# EAGLE design camera (EAGLE 9.6.2)
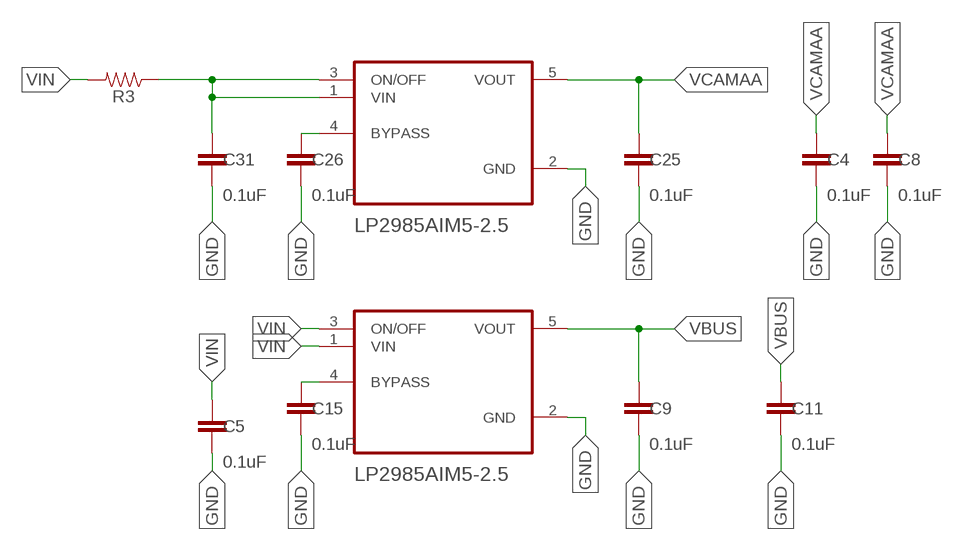
[diagram p0: schematic, sheet 1, part 1 of 3]
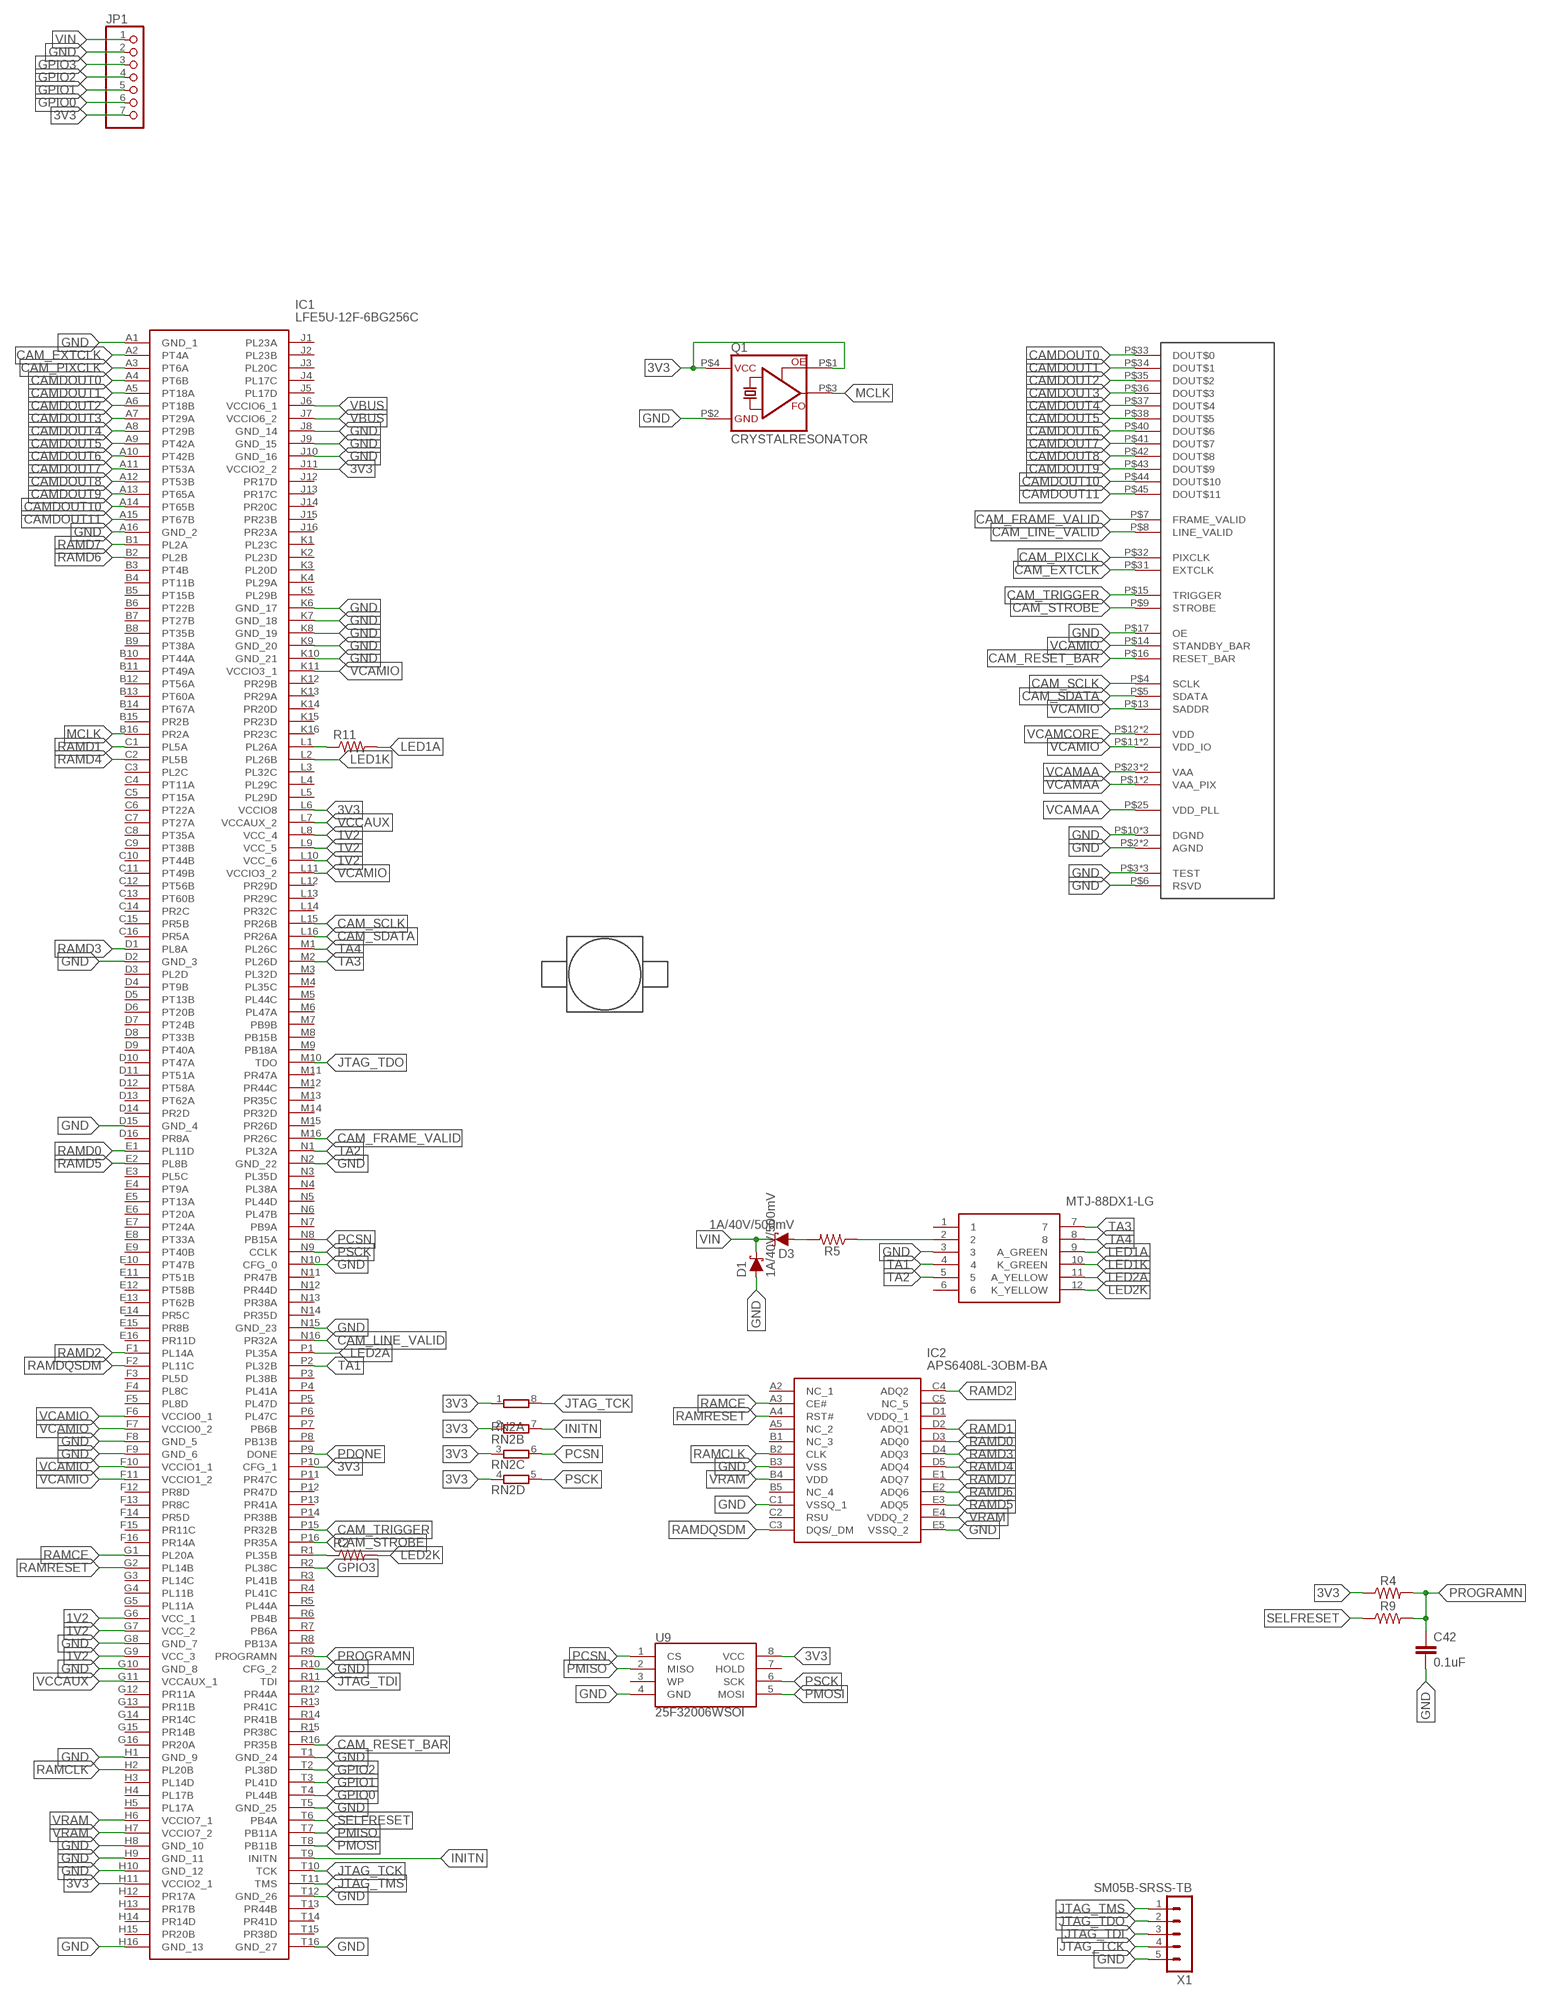
[diagram p1: schematic, sheet 1, part 2 of 3]
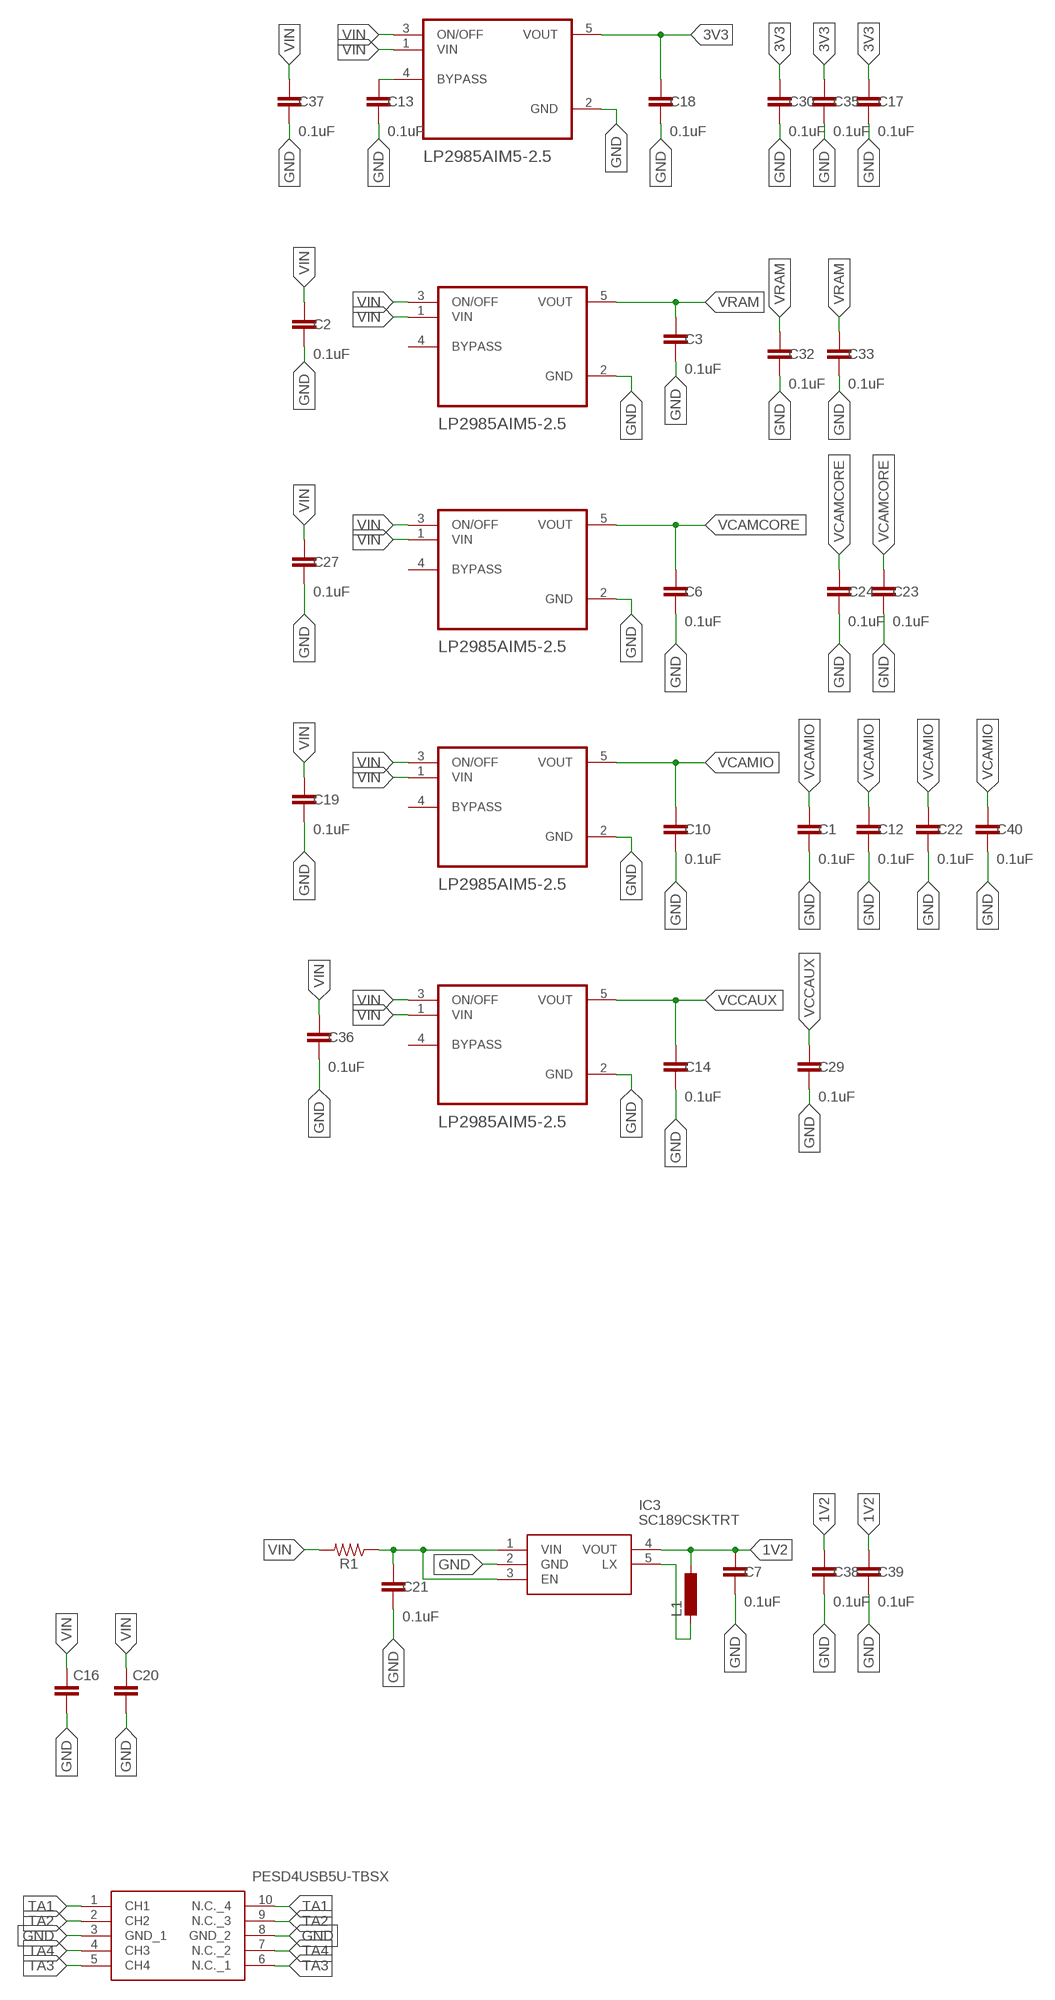
[diagram p2: schematic, sheet 1, part 3 of 3]

## Parts
C1  0.1uF  0.1UF-0603-25V-5%  [0603]
C2  0.1uF  0.1UF-0603-25V-5%  [0603]
C3  0.1uF  0.1UF-0603-25V-5%  [0603]
C4  0.1uF  0.1UF-0603-25V-5%  [0603]
C5  0.1uF  0.1UF-0603-25V-5%  [0603]
C6  0.1uF  0.1UF-0603-25V-5%  [0603]
C7  0.1uF  0.1UF-0603-25V-5%  [0603]
C8  0.1uF  0.1UF-0603-25V-5%  [0603]
C9  0.1uF  0.1UF-0603-25V-5%  [0603]
C10  0.1uF  0.1UF-0603-25V-5%  [0603]
C11  0.1uF  0.1UF-0603-25V-5%  [0603]
C12  0.1uF  0.1UF-0603-25V-5%  [0603]
C13  0.1uF  0.1UF-0603-25V-5%  [0603]
C14  0.1uF  0.1UF-0603-25V-5%  [0603]
C15  0.1uF  0.1UF-0603-25V-5%  [0603]
C16  C-EUC1812  [C1812]
C17  0.1uF  0.1UF-0603-25V-5%  [0603]
C18  0.1uF  0.1UF-0603-25V-5%  [0603]
C19  0.1uF  0.1UF-0603-25V-5%  [0603]
C20  C-EUC1812  [C1812]
C21  0.1uF  0.1UF-0603-25V-5%  [0603]
C22  0.1uF  0.1UF-0603-25V-5%  [0603]
C23  0.1uF  0.1UF-0603-25V-5%  [0603]
C24  0.1uF  0.1UF-0603-25V-5%  [0603]
C25  0.1uF  0.1UF-0603-25V-5%  [0603]
C26  0.1uF  0.1UF-0603-25V-5%  [0603]
C27  0.1uF  0.1UF-0603-25V-5%  [0603]
C29  0.1uF  0.1UF-0603-25V-5%  [0603]
C30  0.1uF  0.1UF-0603-25V-5%  [0603]
C31  0.1uF  0.1UF-0603-25V-5%  [0603]
C32  0.1uF  0.1UF-0603-25V-5%  [0603]
C33  0.1uF  0.1UF-0603-25V-5%  [0603]
C35  0.1uF  0.1UF-0603-25V-5%  [0603]
C36  0.1uF  0.1UF-0603-25V-5%  [0603]
C37  0.1uF  0.1UF-0603-25V-5%  [0603]
C38  0.1uF  0.1UF-0603-25V-5%  [0603]
C39  0.1uF  0.1UF-0603-25V-5%  [0603]
C40  0.1uF  0.1UF-0603-25V-5%  [0603]
C42  0.1uF  0.1UF-0603-25V-5%  [0603]
D1  1A/40V/500mV  DIODE-SCHOTTKY-SS14  [SMA-DIODE]
D3  1A/40V/500mV  DIODE-SCHOTTKY-SS14  [SMA-DIODE]
D10  PESD4USB5U-TBSX  [SON50P100X250X80-10N]
IC1  LFE5U-12F-6BG256C  [BGA256C80P16X16_1400X1400X170]
IC2  APS6408L-3OBM-BA  [BGA24C100P5X5_600X800X120]
IC3  SC189CSKTRT  [SOT95P280X145-5N]
J1  MTJ-88DX1-LG  [MTJ88DX1LG]
JP1  PINHD-1X7M  [1X07M]
L1  L-EUL3230M  [L3230M]
Q1  CRYSTALRESONATOR  [XO53X]
R1  RESISTOR0603  [0603]
R2  RESISTOR0603  [0603]
R3  RESISTOR0603  [0603]
R4  RESISTOR0603  [0603]
R5  RESISTOR0805  [0805]
R9  RESISTOR0603  [0603]
R11  RESISTOR0603  [0603]
RN2  4R-NEXBV8V  [EXBV8V]
U1  LP2985AIM5-2.5  [SOT95P280X145-5N]
U2  LP2985AIM5-2.5  [SOT95P280X145-5N]
U3  LP2985AIM5-2.5  [SOT95P280X145-5N]
U4  LP2985AIM5-2.5  [SOT95P280X145-5N]
U5  LP2985AIM5-2.5  [SOT95P280X145-5N]
U6  LP2985AIM5-2.5  [SOT95P280X145-5N]
U8  LP2985AIM5-2.5  [SOT95P280X145-5N]
U9  25F32006WSOI  SPI_FLASH-X25XXSMD1  [SO08-EIAJ]
U$1  LENS-HOLDER  [LENS-HOLDER]
U$2  MT9P001  [MT9P001]
X1  SM05B-SRSS-TB  [SM05B-SRSS-TB]

## Nets
1V2: C7.1 C38.1 C39.1 IC1.G6(VCC_1) IC1.G7(VCC_2) IC1.G9(VCC_3) IC1.L8(VCC_4) IC1.L9(VCC_5) IC1.L10(VCC_6) IC3.4(VOUT) L1.1
3V3: C17.1 C18.1 C30.1 C35.1 IC1.H11(VCCIO2_1) IC1.J11(VCCIO2_2) IC1.L6(VCCIO8) IC1.P10(CFG_1) JP1.7 Q1.P$1(OE) Q1.P$4(VCC) R4.1 RN2.1 RN2.2 RN2.3 RN2.4 U2.5(VOUT) U9.8(VCC)
CAM_EXTCLK: IC1.A2(PT4A) U$2.P$31(EXTCLK)
CAM_FRAME_VALID: IC1.M16(PR26C) U$2.P$7(FRAME_VALID)
CAM_LINE_VALID: IC1.N16(PR32A) U$2.P$8(LINE_VALID)
CAM_PIXCLK: IC1.A3(PT6A) U$2.P$32(PIXCLK)
CAM_RESET_BAR: IC1.R16(PR35B) U$2.P$16(RESET_BAR)
CAM_SCLK: IC1.L15(PR26B) U$2.P$4(SCLK)
CAM_SDATA: IC1.L16(PR26A) U$2.P$5(SDATA)
CAM_STROBE: IC1.P16(PR35A) U$2.P$9(STROBE)
CAM_TRIGGER: IC1.P15(PR32B) U$2.P$15(TRIGGER)
CAMDOUT0: IC1.A4(PT6B) U$2.P$33(DOUT$0)
CAMDOUT1: IC1.A5(PT18A) U$2.P$34(DOUT$1)
CAMDOUT2: IC1.A6(PT18B) U$2.P$35(DOUT$2)
CAMDOUT3: IC1.A7(PT29A) U$2.P$36(DOUT$3)
CAMDOUT4: IC1.A8(PT29B) U$2.P$37(DOUT$4)
CAMDOUT5: IC1.A9(PT42A) U$2.P$38(DOUT$5)
CAMDOUT6: IC1.A10(PT42B) U$2.P$40(DOUT$6)
CAMDOUT7: IC1.A11(PT53A) U$2.P$41(DOUT$7)
CAMDOUT8: IC1.A12(PT53B) U$2.P$42(DOUT$8)
CAMDOUT9: IC1.A13(PT65A) U$2.P$43(DOUT$9)
CAMDOUT10: IC1.A14(PT65B) U$2.P$44(DOUT$10)
CAMDOUT11: IC1.A15(PT67B) U$2.P$45(DOUT$11)
GND: C1.2 C2.2 C3.2 C4.2 C5.2 C6.2 C7.2 C8.2 C9.2 C10.2 C11.2 C12.2 C13.2 C14.2 C15.2 C16.2 C17.2 C18.2 C19.2 C20.2 C21.2 C22.2 C23.2 C24.2 C25.2 C26.2 C27.2 C29.2 C30.2 C31.2 C32.2 C33.2 C35.2 C36.2 C37.2 C38.2 C39.2 C40.2 C42.2 D1.A D10.3(GND_1) D10.8(GND_2) IC1.A1(GND_1) IC1.A16(GND_2) IC1.D2(GND_3) IC1.D15(GND_4) IC1.F8(GND_5) IC1.F9(GND_6) IC1.G8(GND_7) IC1.G10(GND_8) IC1.H1(GND_9) IC1.H8(GND_10) IC1.H9(GND_11) IC1.H10(GND_12) IC1.H16(GND_13) IC1.J8(GND_14) IC1.J9(GND_15) IC1.J10(GND_16) IC1.K6(GND_17) IC1.K7(GND_18) IC1.K8(GND_19) IC1.K9(GND_20) IC1.K10(GND_21) IC1.N2(GND_22) IC1.N10(CFG_0) IC1.N15(GND_23) IC1.R10(CFG_2) IC1.T1(GND_24) IC1.T5(GND_25) IC1.T12(GND_26) IC1.T16(GND_27) IC2.B3(VSS) IC2.C1(VSSQ_1) IC2.E5(VSSQ_2) IC3.2(GND) J1.3 JP1.2 Q1.P$2(GND) U1.2(GND) U2.2(GND) U3.2(GND) U4.2(GND) U5.2(GND) U6.2(GND) U8.2(GND) U9.4(GND) U$2.P$2(AGND) U$2.P$3(TEST) U$2.P$6(RSVD) U$2.P$10(DGND) U$2.P$17(OE) U$2.P$20(TEST) U$2.P$21(TEST) U$2.P$22(AGND) U$2.P$26(DGND) U$2.P$46(DGND) X1.5
GPIO0: IC1.T4(PL44B) JP1.6
GPIO1: IC1.T3(PL41D) JP1.5
GPIO2: IC1.T2(PL38D) JP1.4
GPIO3: IC1.R2(PL38C) JP1.3
INITN: IC1.T9(INITN) RN2.7
JTAG_TCK: IC1.T10(TCK) RN2.8 X1.4
JTAG_TDI: IC1.R11(TDI) X1.3
JTAG_TDO: IC1.M10(TDO) X1.2
JTAG_TMS: IC1.T11(TMS) X1.1
LED1A: J1.9(A_GREEN) R11.2
LED1K: IC1.L2(PL26B) J1.10(K_GREEN)
LED2A: IC1.P1(PL35A) J1.11(A_YELLOW)
LED2K: J1.12(K_YELLOW) R2.2
MCLK: IC1.B16(PR2A) Q1.P$3(FO)
N$1: C15.1 U1.4(BYPASS)
N$2: C13.1 U2.4(BYPASS)
N$3: IC3.5(LX) L1.2
N$4: IC1.R1(PL35B) R2.1
N$5: C21.1 IC3.1(VIN) IC3.3(EN) R1.1
N$6: C31.1 R3.1 U8.1(VIN) U8.3(ON/OFF)
N$8: IC1.L1(PL26A) R11.1
N$9: J1.2 R5.1
N$10: C26.1 U8.4(BYPASS)
N$15: D3.A R5.2
PCSN: IC1.N8(PB15A) RN2.6 U9.1(CS)
PDONE: IC1.P9(DONE)
PMISO: IC1.T7(PB11A) U9.2(MISO)
PMOSI: IC1.T8(PB11B) U9.5(MOSI)
PROGRAMN: C42.1 IC1.R9(PROGRAMN) R4.2 R9.2
PSCK: IC1.N9(CCLK) RN2.5 U9.6(SCK)
RAMCE: IC1.G1(PL20A) IC2.A3(CE#)
RAMCLK: IC1.H2(PL20B) IC2.B2(CLK)
RAMD0: IC1.E1(PL11D) IC2.D3(ADQ0)
RAMD1: IC1.C1(PL5A) IC2.D2(ADQ1)
RAMD2: IC1.F1(PL14A) IC2.C4(ADQ2)
RAMD3: IC1.D1(PL8A) IC2.D4(ADQ3)
RAMD4: IC1.C2(PL5B) IC2.D5(ADQ4)
RAMD5: IC1.E2(PL8B) IC2.E3(ADQ5)
RAMD6: IC1.B2(PL2B) IC2.E2(ADQ6)
RAMD7: IC1.B1(PL2A) IC2.E1(ADQ7)
RAMDQSDM: IC1.F2(PL11C) IC2.C3(DQS/_DM)
RAMRESET: IC1.G2(PL14B) IC2.A4(RST#)
SELFRESET: IC1.T6(PB4A) R9.1
TA1: D10.1(CH1) D10.10(N.C._4) IC1.P2(PL32B) J1.4
TA2: D10.2(CH2) D10.9(N.C._3) IC1.N1(PL32A) J1.5
TA3: D10.5(CH4) D10.6(N.C._1) IC1.M2(PL26D) J1.7
TA4: D10.4(CH3) D10.7(N.C._2) IC1.M1(PL26C) J1.8
VBUS: C9.1 C11.1 IC1.J6(VCCIO6_1) IC1.J7(VCCIO6_2) U1.5(VOUT)
VCAMAA: C4.1 C8.1 C25.1 U8.5(VOUT) U$2.P$1(VAA_PIX) U$2.P$23(VAA) U$2.P$24(VAA) U$2.P$25(VDD_PLL) U$2.P$48(VAA_PIX)
VCAMCORE: C6.1 C23.1 C24.1 U4.5(VOUT) U$2.P$12(VDD) U$2.P$47(VDD)
VCAMIO: C1.1 C10.1 C12.1 C22.1 C40.1 IC1.F6(VCCIO0_1) IC1.F7(VCCIO0_2) IC1.F10(VCCIO1_1) IC1.F11(VCCIO1_2) IC1.K11(VCCIO3_1) IC1.L11(VCCIO3_2) U5.5(VOUT) U$2.P$11(VDD_IO) U$2.P$13(SADDR) U$2.P$14(STANDBY_BAR) U$2.P$39(VDD_IO)
VCCAUX: C14.1 C29.1 IC1.G11(VCCAUX_1) IC1.L7(VCCAUX_2) U6.5(VOUT)
VIN: C2.1 C5.1 C16.1 C19.1 C20.1 C27.1 C36.1 C37.1 D1.C D3.C JP1.1 R1.2 R3.2 U1.1(VIN) U1.3(ON/OFF) U2.1(VIN) U2.3(ON/OFF) U3.1(VIN) U3.3(ON/OFF) U4.1(VIN) U4.3(ON/OFF) U5.1(VIN) U5.3(ON/OFF) U6.1(VIN) U6.3(ON/OFF)
VRAM: C3.1 C32.1 C33.1 IC1.H6(VCCIO7_1) IC1.H7(VCCIO7_2) IC2.B4(VDD) IC2.E4(VDDQ_2) U3.5(VOUT)
Unconnected: IC1.B3(PT4B) IC1.B4(PT11B) IC1.B5(PT15B) IC1.B6(PT22B) IC1.B7(PT27B) IC1.B8(PT35B) IC1.B9(PT38A) IC1.B10(PT44A) IC1.B11(PT49A) IC1.B12(PT56A) IC1.B13(PT60A) IC1.B14(PT67A) IC1.B15(PR2B) IC1.C3(PL2C) IC1.C4(PT11A) IC1.C5(PT15A) IC1.C6(PT22A) IC1.C7(PT27A) IC1.C8(PT35A) IC1.C9(PT38B) IC1.C10(PT44B) IC1.C11(PT49B) IC1.C12(PT56B) IC1.C13(PT60B) IC1.C14(PR2C) IC1.C15(PR5B) IC1.C16(PR5A) IC1.D3(PL2D) IC1.D4(PT9B) IC1.D5(PT13B) IC1.D6(PT20B) IC1.D7(PT24B) IC1.D8(PT33B) IC1.D9(PT40A) IC1.D10(PT47A) IC1.D11(PT51A) IC1.D12(PT58A) IC1.D13(PT62A) IC1.D14(PR2D) IC1.D16(PR8A) IC1.E3(PL5C) IC1.E4(PT9A) IC1.E5(PT13A) IC1.E6(PT20A) IC1.E7(PT24A) IC1.E8(PT33A) IC1.E9(PT40B) IC1.E10(PT47B) IC1.E11(PT51B) IC1.E12(PT58B) IC1.E13(PT62B) IC1.E14(PR5C) IC1.E15(PR8B) IC1.E16(PR11D) IC1.F3(PL5D) IC1.F4(PL8C) IC1.F5(PL8D) IC1.F12(PR8D) IC1.F13(PR8C) IC1.F14(PR5D) IC1.F15(PR11C) IC1.F16(PR14A) IC1.G3(PL14C) IC1.G4(PL11B) IC1.G5(PL11A) IC1.G12(PR11A) IC1.G13(PR11B) IC1.G14(PR14C) IC1.G15(PR14B) IC1.G16(PR20A) IC1.H3(PL14D) IC1.H4(PL17B) IC1.H5(PL17A) IC1.H12(PR17A) IC1.H13(PR17B) IC1.H14(PR14D) IC1.H15(PR20B) IC1.J1(PL23A) IC1.J2(PL23B) IC1.J3(PL20C) IC1.J4(PL17C) IC1.J5(PL17D) IC1.J12(PR17D) IC1.J13(PR17C) IC1.J14(PR20C) IC1.J15(PR23B) IC1.J16(PR23A) IC1.K1(PL23C) IC1.K2(PL23D) IC1.K3(PL20D) IC1.K4(PL29A) IC1.K5(PL29B) IC1.K12(PR29B) IC1.K13(PR29A) IC1.K14(PR20D) IC1.K15(PR23D) IC1.K16(PR23C) IC1.L3(PL32C) IC1.L4(PL29C) IC1.L5(PL29D) IC1.L12(PR29D) IC1.L13(PR29C) IC1.L14(PR32C) IC1.M3(PL32D) IC1.M4(PL35C) IC1.M5(PL44C) IC1.M6(PL47A) IC1.M7(PB9B) IC1.M8(PB15B) IC1.M9(PB18A) IC1.M11(PR47A) IC1.M12(PR44C) IC1.M13(PR35C) IC1.M14(PR32D) IC1.M15(PR26D) IC1.N3(PL35D) IC1.N4(PL38A) IC1.N5(PL44D) IC1.N6(PL47B) IC1.N7(PB9A) IC1.N11(PR47B) IC1.N12(PR44D) IC1.N13(PR38A) IC1.N14(PR35D) IC1.P3(PL38B) IC1.P4(PL41A) IC1.P5(PL47D) IC1.P6(PL47C) IC1.P7(PB6B) IC1.P8(PB13B) IC1.P11(PR47C) IC1.P12(PR47D) IC1.P13(PR41A) IC1.P14(PR38B) IC1.R3(PL41B) IC1.R4(PL41C) IC1.R5(PL44A) IC1.R6(PB4B) IC1.R7(PB6A) IC1.R8(PB13A) IC1.R12(PR44A) IC1.R13(PR41C) IC1.R14(PR41B) IC1.R15(PR38C) IC1.T13(PR44B) IC1.T14(PR41D) IC1.T15(PR38D) IC2.A2(NC_1) IC2.A5(NC_2) IC2.B1(NC_3) IC2.B5(NC_4) IC2.C2(RSU) IC2.C5(NC_5) IC2.D1(VDDQ_1) J1.1 J1.6 U3.4(BYPASS) U4.4(BYPASS) U5.4(BYPASS) U6.4(BYPASS) U9.3(WP) U9.7(HOLD)

## Library data of the parts
C1-C15 C17-C19 C21-C27 C29-C33 C35-C40 C42 = SparkFun-Capacitors:0.1UF: 0.1µF ceramic capacitors A capacitor is a passive two-terminal electrical component used to store electrical energy temporarily in an electric field.; PROD_ID: CAP-08604
C16 C20 = rcl:C-EU: CAPACITOR, European symbol; SPICEPREFIX: C
D1 D3 = SparkFun-DiscreteSemi:DIODE-SCHOTTKY: Schottky diode A Schottky diode is a semiconductor diode which has a low forward voltage drop and a very fast switching action.; PROD_ID: DIO-08053
D10 = PESD4USB5U-TBSX:PESD4USB5U-TBSX: ESD Suppressors / TVS Diodes TVS DIODES Source: Datasheet <https://assets.nexperia.com/documents/data-sheet/PESD4USB5U-TBS.pdf>; DESCRIPTION: ESD Suppressors / TVS Diodes TVS DIODES; HEIGHT: 0.8mm; MANUFACTURER_NAME: Nexperia; MANUFACTURER_PART_NUMBER: PESD4USB5U-TBSX; MOUSER_PART_NUMBER: 771-PESD4USB5U-TBSX; MOUSER_PRICE-STOCK: https://www.mouser.co.uk/ProductDetail/Nexperia/PESD4USB5U-TBSX?qs=ljCeji4nMDmlBRiGiyUt1A%3D%3D
IC1 = LFE5U-12F-6BG256C:LFE5U-12F-6BG256C: FPGA - Field Programmable Gate Array ECP5; 12k LUTs; 1.1V Source: Datasheet <http://www.latticesemi.com/-/media/LatticeSemi/Documents/DataSheets/ECP5/FPGA-DS-02012-1-9-ECP5-ECP5G-Family-Data-Sheet.ashx?document_id=50461> Check prices <https://pricing.snapeda.com/parts/LFE5U-12F-6BG256C/Lattice%20Semiconductor/view-part?ref=eda>; AVAILABILITY: Warning; DESCRIPTION: ECP5 Field Programmable Gate Array (FPGA) IC 197 589824 12000 256-LFBGA; MF: Lattice Semiconductor; MP: LFE5U-12F-6BG256C; PACKAGE: CABGA-256 Lattice Semiconductor; PRICE: None; PURCHASE-URL: https://pricing.snapeda.com/search/part/LFE5U-12F-6BG256C/?ref=eda
IC2 = APS6408L-3OBM-BA:APS6408L-3OBM-BA: DRAM IoT RAM 64Mb OPI (x8) DDR 133MHz, 3V, Ind. Temp., BGA24 Source: Datasheet <https://www.mouser.jp/datasheet/2/1127/APM_PSRAM_OPI_Xccela_APS6408L_3OBMx_v3_5b_PKG-1954852.pdf>; DESCRIPTION: DRAM IoT RAM 64Mb OPI (x8) DDR 133MHz, 3V, Ind. Temp., BGA24; HEIGHT: 1.2mm; MANUFACTURER_NAME: AP Memory; MANUFACTURER_PART_NUMBER: APS6408L-3OBM-BA; MOUSER_PART_NUMBER: 878-APS6408L-3OBM-BA; MOUSER_PRICE-STOCK: https://www.mouser.co.uk/ProductDetail/AP-Memory/APS6408L-3OBM-BA?qs=IS%252B4QmGtzzowqQ04s%2FoaHA%3D%3D
IC3 = SC189CSKTRT:SC189CSKTRT: Conv DC-DC 2.9V to 5.5V Synchronous Step Down Single-Out 1.2V 1.5A 6-Pin MLPD-UT T/R Source: Datasheet <https://datasheet.datasheetarchive.com/originals/distributors/Datasheets-DGA14/1272982.pdf>; ARROW_PART_NUMBER: SC189CSKTRT; ARROW_PRICE-STOCK: https://www.arrow.com/en/products/sc189csktrt/semtech; DESCRIPTION: Conv DC-DC 2.9V to 5.5V Synchronous Step Down Single-Out 1.2V 1.5A 6-Pin MLPD-UT T/R; HEIGHT: 1.45mm; MANUFACTURER_NAME: SEMTECH; MANUFACTURER_PART_NUMBER: SC189CSKTRT; MOUSER_PART_NUMBER: 947-SC189CSKTRT; MOUSER_PRICE-STOCK: https://www.mouser.co.uk/ProductDetail/Semtech/SC189CSKTRT?qs=rBWM4%252BvDhIcKNVCFfiXT%2Fw%3D%3D
J1 = MTJ-88DX1-LG:MTJ-88DX1-LG: Jack Modular Connector 8p8c (RJ45, Ethernet) Vertical Unshielded Source: Datasheet <https://app.adam-tech.com/products/download/data_sheet/203911/mtj-88dx1-lg-data-sheet.pdf>; DESCRIPTION: Jack Modular Connector 8p8c (RJ45, Ethernet) Vertical Unshielded; HEIGHT: 16.7894mm; MANUFACTURER_NAME: Adam Tech; MANUFACTURER_PART_NUMBER: MTJ-88DX1-LG
JP1 = pinhead:PINHD-1X7: PIN HEADER
L1 = rcl:L-EU: INDUCTOR, European symbol; SPICEPREFIX: L
Q1 = Crystals-new:CRYSTALRESONATOR
R1-R5 R9 R11 = SparkFun-Resistors:RESISTOR: Generic Resistor Package
RN2 = resistor-dil:4R-N: Array Chip Resistor Source: RS Component / Phycomp; OC_FARNELL: unknown; OC_NEWARK: unknown
U1-U6 U8 = LP2985AIM5-2.5:LP2985AIM5-2.5: Check prices <https://pricing.snapeda.com/parts/LP2985AIM5-2.5/NOPB/Texas%20Instruments/view-part?ref=eda>; AVAILABILITY: In Stock; DESCRIPTION: 150-mA, 16-V, low-dropout voltage regulator with enable 5-SOT-23 -40 to 125; MF: Texas Instruments; MP: LP2985AIM5-2.5/NOPB; PACKAGE: SOT-23-5 Texas Instruments; PRICE: None; PURCHASE-URL: https://pricing.snapeda.com/search/part/LP2985AIM5-2.5/NOPB/?ref=eda
U9 = SparkFun-IC-Memory:SPI_FLASH-X25XX: 32M Serial Flash Memory 8pin SPI Flash series x25xx. Works with devices like W25X32 and BR25L32 Datasheet <http://www.macronix.com/Lists/Datasheet/Attachments/5031/MX25L3206E,%203V,%2032Mb,%20v1.5.pdf> SparkFun Products SparkFun Venus GPS Logger <https://www.sparkfun.com/products/10920> (GPS-10920); PROD_ID: IC-09109
U$1 = lens-older:LENS-HOLDER
U$2 = MT9P001-b:MT9P001
X1 = con-JST SH (2):SM05B-SRSS: JST SH series header 1.00mm pitch disconnectable crimp style connectors, horizontal (side entry type), 5 pins

## Board
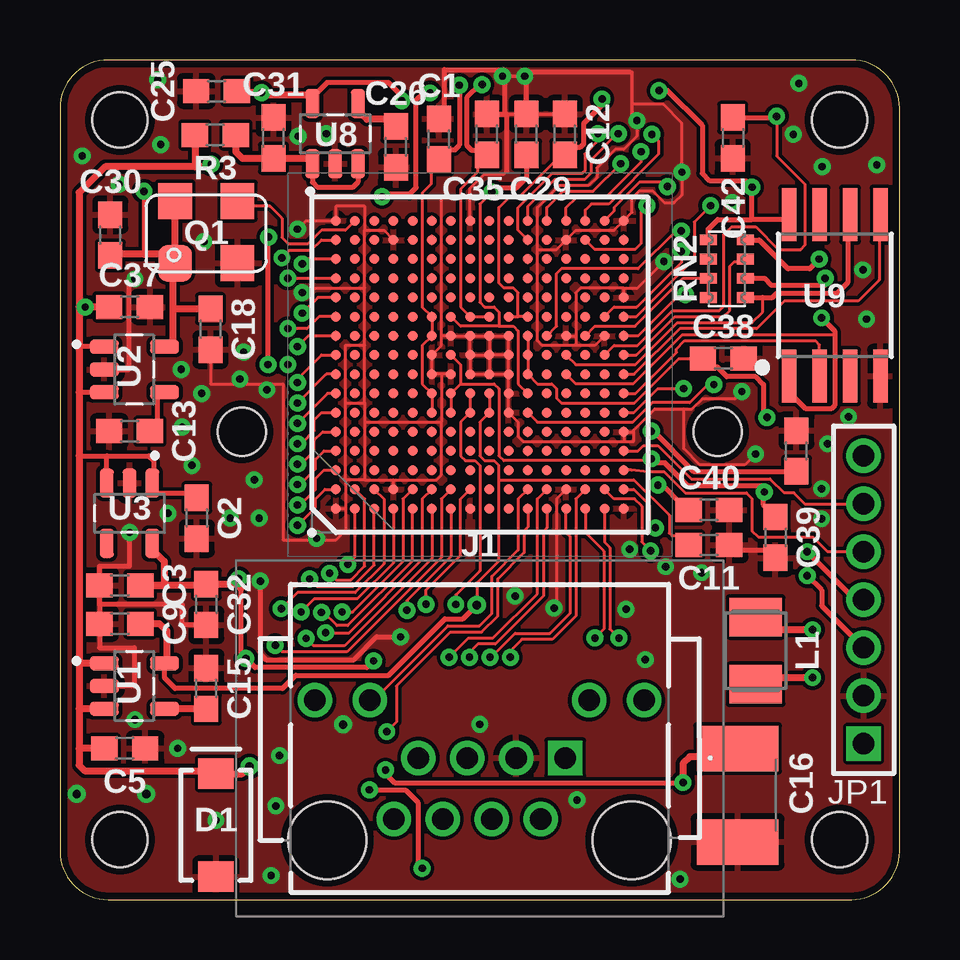
[diagram p3: board, top side]
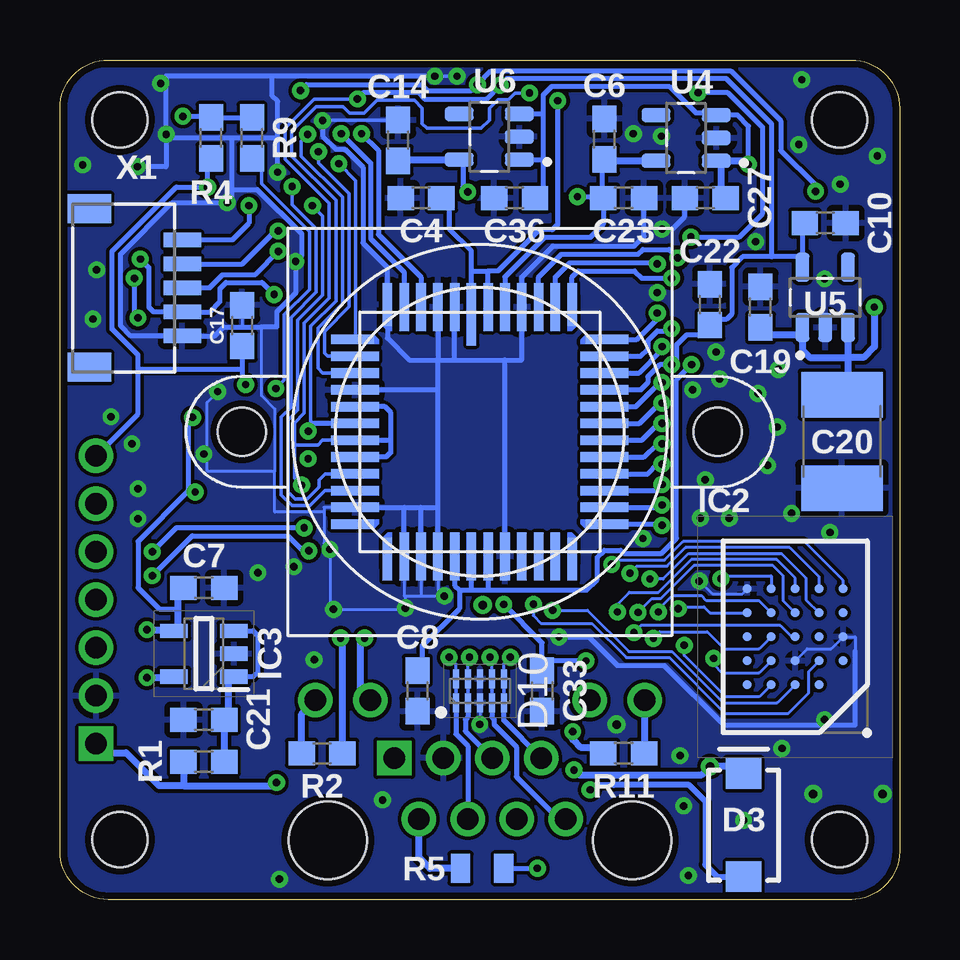
[diagram p4: board, bottom side, seen from below]

Size 35 x 35 mm. Coordinates in mm from the lower left corner, seen from the top.
Outline: 0,33 0,2 arc90 2,0 33,0 arc90 35,2 35,33 arc90 33,35 2,35 arc90 0,33
Copper layers (1*16): Top 0.035mm / dielectric 1.5mm / Bottom 0.035mm
Design rules "default *": minimum track width 0.125mm, minimum drill 0.3mm, track to track 0.125mm, track to pad 0.125mm, pad to pad 0.125mm, via to via 0.125mm, smd to smd 0mil, copper to edge 0.3mm, drill to drill 0.25mm, minimum pad ring 10mil, minimum via ring 8mil, stop-mask expansion 4mil, vias tented up to drill 4mm, thermal gap 10mil
Holes 2.3 mm at 2.5,32.5 32.5,32.5 32.5,2.5 2.5,2.5

### Footprints (pad centres in the part's own frame; a part is rotated, then mirrored left to right if it is on the bottom)
0603 = smd 1.1 x 1: 1 -0.85,0; 2 0.85,0
C1812 = smd 1.9 x 3.4: 1 -1.95,0; 2 1.95,0
SMA-DIODE = smd 1.27 x 1.47: A -2.15,0; C 2.15,0
SON50P100X250X80-10N = smd 0.8 x 0.25: 1 -0.5,1; 2 -0.5,0.5; 3 -0.5,0; 4 -0.5,-0.5; 5 -0.5,-1; 6 0.5,-1; 7 0.5,-0.5; 8 0.5,0; 9 0.5,0.5; 10 0.5,1
BGA256C80P16X16_1400X1400X170 = smd 0.41 x 0.41: A1 -6,6; A2 -5.2,6; A3 -4.4,6; A4 -3.6,6; A5 -2.8,6; A6 -2,6; A7 -1.2,6; A8 -0.4,6; A9 0.4,6; A10 1.2,6; A11 2,6; A12 2.8,6; A13 3.6,6; A14 4.4,6; A15 5.2,6; A16 6,6; B1 -6,5.2; B2 -5.2,5.2; B3 -4.4,5.2; B4 -3.6,5.2; B5 -2.8,5.2; B6 -2,5.2; B7 -1.2,5.2; B8 -0.4,5.2; B9 0.4,5.2; B10 1.2,5.2; B11 2,5.2; B12 2.8,5.2; B13 3.6,5.2; B14 4.4,5.2; B15 5.2,5.2; B16 6,5.2; C1 -6,4.4; C2 -5.2,4.4; C3 -4.4,4.4; C4 -3.6,4.4; C5 -2.8,4.4; C6 -2,4.4; C7 -1.2,4.4; C8 -0.4,4.4; C9 0.4,4.4; C10 1.2,4.4; C11 2,4.4; C12 2.8,4.4; C13 3.6,4.4; C14 4.4,4.4; C15 5.2,4.4; C16 6,4.4; D1 -6,3.6; D2 -5.2,3.6; D3 -4.4,3.6; D4 -3.6,3.6; D5 -2.8,3.6; D6 -2,3.6; D7 -1.2,3.6; D8 -0.4,3.6; D9 0.4,3.6; D10 1.2,3.6; D11 2,3.6; D12 2.8,3.6; D13 3.6,3.6; D14 4.4,3.6; D15 5.2,3.6; D16 6,3.6; E1 -6,2.8; E2 -5.2,2.8; E3 -4.4,2.8; E4 -3.6,2.8; E5 -2.8,2.8; E6 -2,2.8; E7 -1.2,2.8; E8 -0.4,2.8; E9 0.4,2.8; E10 1.2,2.8; E11 2,2.8; E12 2.8,2.8; E13 3.6,2.8; E14 4.4,2.8; E15 5.2,2.8; E16 6,2.8; F1 -6,2; F2 -5.2,2; F3 -4.4,2; F4 -3.6,2; F5 -2.8,2; F6 -2,2; F7 -1.2,2; F8 -0.4,2; F9 0.4,2; F10 1.2,2; F11 2,2; F12 2.8,2; F13 3.6,2; F14 4.4,2; F15 5.2,2; F16 6,2; G1 -6,1.2; G2 -5.2,1.2; G3 -4.4,1.2; G4 -3.6,1.2; G5 -2.8,1.2; G6 -2,1.2; G7 -1.2,1.2; G8 -0.4,1.2; G9 0.4,1.2; G10 1.2,1.2; G11 2,1.2; G12 2.8,1.2; G13 3.6,1.2; G14 4.4,1.2; G15 5.2,1.2; G16 6,1.2; H1 -6,0.4; H2 -5.2,0.4; H3 -4.4,0.4; H4 -3.6,0.4; H5 -2.8,0.4; H6 -2,0.4; H7 -1.2,0.4; H8 -0.4,0.4; H9 0.4,0.4; H10 1.2,0.4; H11 2,0.4; H12 2.8,0.4; H13 3.6,0.4; H14 4.4,0.4; H15 5.2,0.4; H16 6,0.4; J1 -6,-0.4; J2 -5.2,-0.4; J3 -4.4,-0.4; J4 -3.6,-0.4; J5 -2.8,-0.4; J6 -2,-0.4; J7 -1.2,-0.4; J8 -0.4,-0.4; J9 0.4,-0.4; J10 1.2,-0.4; J11 2,-0.4; J12 2.8,-0.4; J13 3.6,-0.4; J14 4.4,-0.4; J15 5.2,-0.4; J16 6,-0.4; K1 -6,-1.2; K2 -5.2,-1.2; K3 -4.4,-1.2; K4 -3.6,-1.2; K5 -2.8,-1.2; K6 -2,-1.2; K7 -1.2,-1.2; K8 -0.4,-1.2; K9 0.4,-1.2; K10 1.2,-1.2; K11 2,-1.2; K12 2.8,-1.2; K13 3.6,-1.2; K14 4.4,-1.2; K15 5.2,-1.2; K16 6,-1.2; L1 -6,-2; L2 -5.2,-2; L3 -4.4,-2; L4 -3.6,-2; L5 -2.8,-2; L6 -2,-2; L7 -1.2,-2; L8 -0.4,-2; L9 0.4,-2; L10 1.2,-2; L11 2,-2; L12 2.8,-2; L13 3.6,-2; L14 4.4,-2; L15 5.2,-2; L16 6,-2; M1 -6,-2.8; M2 -5.2,-2.8; M3 -4.4,-2.8; M4 -3.6,-2.8; M5 -2.8,-2.8; M6 -2,-2.8; M7 -1.2,-2.8; M8 -0.4,-2.8; M9 0.4,-2.8; M10 1.2,-2.8; M11 2,-2.8; M12 2.8,-2.8; M13 3.6,-2.8; M14 4.4,-2.8; M15 5.2,-2.8; M16 6,-2.8; N1 -6,-3.6; N2 -5.2,-3.6; N3 -4.4,-3.6; N4 -3.6,-3.6; N5 -2.8,-3.6; N6 -2,-3.6; N7 -1.2,-3.6; N8 -0.4,-3.6; N9 0.4,-3.6; N10 1.2,-3.6; N11 2,-3.6; N12 2.8,-3.6; N13 3.6,-3.6; N14 4.4,-3.6; N15 5.2,-3.6; N16 6,-3.6; P1 -6,-4.4; P2 -5.2,-4.4; P3 -4.4,-4.4; P4 -3.6,-4.4; P5 -2.8,-4.4; P6 -2,-4.4; P7 -1.2,-4.4; P8 -0.4,-4.4; P9 0.4,-4.4; P10 1.2,-4.4; P11 2,-4.4; P12 2.8,-4.4; P13 3.6,-4.4; P14 4.4,-4.4; P15 5.2,-4.4; P16 6,-4.4; R1 -6,-5.2; R2 -5.2,-5.2; R3 -4.4,-5.2; R4 -3.6,-5.2; R5 -2.8,-5.2; R6 -2,-5.2; R7 -1.2,-5.2; R8 -0.4,-5.2; R9 0.4,-5.2; R10 1.2,-5.2; R11 2,-5.2; R12 2.8,-5.2; R13 3.6,-5.2; R14 4.4,-5.2; R15 5.2,-5.2; R16 6,-5.2; T1 -6,-6; T2 -5.2,-6; T3 -4.4,-6; T4 -3.6,-6; T5 -2.8,-6; T6 -2,-6; T7 -1.2,-6; T8 -0.4,-6; T9 0.4,-6; T10 1.2,-6; T11 2,-6; T12 2.8,-6; T13 3.6,-6; T14 4.4,-6; T15 5.2,-6; T16 6,-6
BGA24C100P5X5_600X800X120 = smd 0.37 x 0.37: A2 -1,2; A3 0,2; A4 1,2; A5 2,2; B1 -2,1; B2 -1,1; B3 0,1; B4 1,1; B5 2,1; C1 -2,0; C2 -1,0; C3 0,0; C4 1,0; C5 2,0; D1 -2,-1; D2 -1,-1; D3 0,-1; D4 1,-1; D5 2,-1; E1 -2,-2; E2 -1,-2; E3 0,-2; E4 1,-2; E5 2,-2
SOT95P280X145-5N = smd 1.15 x 0.6: 1 -1.25,0.95; 2 -1.25,0; 3 -1.25,-0.95; 4 1.25,-0.95; 5 1.25,0.95
MTJ88DX1LG = drill 0.89 pad 1.446 square: 1 3.56,0 | drill 0.89 pad 1.446: 2 2.54,-2.54; 3 1.52,0; 4 0.5,-2.54; 5 -0.52,0; 6 -1.54,-2.54; 7 -2.56,0; 8 -3.58,-2.54; 9 -6.87,2.41; 10 -4.58,2.41; 11 4.56,2.41; 12 6.85,2.41 | hole 3.25: 6.34,-3.43; -6.36,-3.43
1X07M = drill 0.914 square: 1 -6,0 | drill 0.914: 2 -4,0; 3 -2,0; 4 0,0; 5 2,0; 6 4,0; 7 6,0
L3230M = smd 1.6 x 2.2: 1 -1.4,0; 2 1.4,0
XO53X = smd 1.4 x 1.5: P$1 -1.3,-1.25; P$2 1.3,-1.25; P$3 1.3,1.35; P$4 -1.3,1.35
0805 = smd 0.8 x 1.2: 1 -0.9,0; 2 0.9,0
EXBV8V = smd 0.45 x 0.7: 1 -1.2,-0.775; 2 -0.4,-0.775; 3 0.4,-0.775; 4 1.2,-0.775; 5 1.2,0.775; 6 0.4,0.775; 7 -0.4,0.775; 8 -1.2,0.775
SOT95P280X145-5N' = smd 1.21 x 0.59: 1 -1.255,0.95; 2 -1.255,0; 3 -1.255,-0.95; 4 1.255,-0.95; 5 1.255,0.95
SO08-EIAJ = smd 0.61 x 2.21: 1 -1.905,-3.378; 2 -0.635,-3.378; 3 0.635,-3.378; 4 1.905,-3.378; 5 1.905,3.353; 6 0.635,3.353; 7 -0.635,3.353; 8 -1.905,3.353
LENS-HOLDER = hole 2: 9.92,0; -9.92,0
MT9P001 = smd 0.4 x 2.6: P$1 -0.35,4.9 | smd 0.4 x 2: P$2 -1.05,5.2; P$3 -1.75,5.2; P$4 -2.45,5.2; P$5 -3.15,5.2; P$20 -3.15,-5.2; P$21 -2.45,-5.2; P$22 -1.75,-5.2; P$23 -1.05,-5.2; P$24 -0.35,-5.2; P$25 0.35,-5.2; P$26 1.05,-5.2; P$27 1.75,-5.2; P$28 2.45,-5.2; P$29 3.15,-5.2; P$44 3.15,5.2; P$45 2.45,5.2; P$46 1.75,5.2; P$47 1.05,5.2; P$48 0.35,5.2 | smd 0.4 x 1.8: P$6 -3.85,5.3; P$19 -3.85,-5.3; P$30 3.85,-5.3; P$43 3.85,5.3 | smd 1.8 x 0.4: P$7 -5.3,3.85; P$18 -5.3,-3.85; P$31 5.3,-3.85; P$42 5.3,3.85 | smd 2 x 0.4: P$8 -5.2,3.15; P$9 -5.2,2.45; P$10 -5.2,1.75; P$11 -5.2,1.05; P$12 -5.2,0.35; P$13 -5.2,-0.35; P$14 -5.2,-1.05; P$15 -5.2,-1.75; P$16 -5.2,-2.45; P$17 -5.2,-3.15; P$32 5.2,-3.15; P$33 5.2,-2.45; P$34 5.2,-1.75; P$35 5.2,-1.05; P$36 5.2,-0.35; P$37 5.2,0.35; P$38 5.2,1.05; P$39 5.2,1.75; P$40 5.2,2.45; P$41 5.2,3.15
SM05B-SRSS-TB = smd 0.6 x 1.55: 1 2,0; 2 1,0; 3 0,0; 4 -1,0; 5 -2,0 | smd 1.2 x 1.8: M1 3.3,3.875; M2 -3.3,3.875

### Placement (x,y rotation side)
C1  15.8,31.7 90 top
C2  5.7,15.9 270 top
C3  2.5,13.1 180 top
C4  19.95,29.25 180 bottom
C5  2.7,6.3 0 top
C6  12.3,31.7 90 bottom
C7  29,13 0 bottom
C8  20.1,8.7 270 bottom
C9  2.5,11.5 180 top
C10  3.1,28.2 0 bottom
C11  27.05,14.77 0 top
C12  21.05,31.9 90 top
C13  2.9,19.52 180 top
C14  20.9,31.65 90 bottom
C15  6.1,8.8 90 top
C16  28.25,4.35 270 top
C17  27.4,23.93 90 bottom
C18  6.28,23.77 270 top
C19  5.8,24.7 90 bottom
C20  2.4,19.1 270 bottom
C21  29,7.5 180 bottom
C22  7.9,24.8 90 bottom
C23  11.5,29.25 0 bottom
C24  30.7,18.7 90 top
C25  6.53,33.7 180 top
C26  14,31.38 270 top
C27  8.1,29.25 180 bottom
C29  19.45,31.9 90 top
C30  2.1,27.7 90 top
C31  8.9,31.75 90 top
C32  6.1,12.3 270 top
C33  14.9,8.7 270 bottom
C35  17.8,31.9 90 top
C36  16.05,29.25 180 bottom
C37  2.9,24.7 0 top
C38  27.65,22.55 0 top
C39  29.83,15.1 270 top
C40  27.05,16.25 0 top
C42  28.05,31.75 270 top
D1  6.5,3.1 90 top
D3  6.5,3.1 90 bottom
D10  17.5,8.7 90 bottom
IC1  17.5,22.3 90 top
IC2  4.35,10.95 180 bottom
IC3  29,10.25 180 bottom
J1  17.5,5.9 0 top
JP1  33.5,12.5 90 top
L1  29,10.38 270 top
Q1  6.1,27.77 0 top
R1  29,5.75 180 bottom
R2  24.07,6.1 180 bottom
R3  6.47,31.88 180 top
R4  28.7,31.75 90 bottom
R5  17.4,1.3 0 bottom
R9  27,31.75 90 bottom
R11  11.5,6.1 0 bottom
RN2  27.8,26.3 270 top
U1  LP2985AIM5-2.5  [SOT95P280X145-5N']  3.1,8.9 0 top
U2  LP2985AIM5-2.5  [SOT95P280X145-5N']  3.1,22.1 0 top
U3  LP2985AIM5-2.5  [SOT95P280X145-5N']  2.9,16.1 270 top
U4  LP2985AIM5-2.5  [SOT95P280X145-5N']  8.9,31.75 180 bottom
U5  LP2985AIM5-2.5  [SOT95P280X145-5N']  3.1,25.1 90 bottom
U6  LP2985AIM5-2.5  [SOT95P280X145-5N']  17.1,31.8 180 bottom
U8  LP2985AIM5-2.5  [SOT95P280X145-5N']  11.48,31.92 90 top
U9  32.3,25.2 0 top
U$1  17.5,19.5 0 bottom
U$2  17.5,19.5 0 bottom
X1  29.9,25.5 90 bottom

### Tracks (layer width: path | path; a pad name or v marks a point on that pad's centre or on a via)
1V2  (via drill 0.3)
  Top 0.125: IC1.G9 16.7,22.3 16.7,21.5 | 16.7,21.5 IC1.G7 IC1.G6 | 16.7,21.5 18.1,21.5 18.3,21.3 18.3,18.5 18.5,18.3 24.58,18.3 v24.65,18.38 | IC1.L10 IC1.L9 IC1.L8 19.9,21.5 20.5,21.5 20.7,21.3 20.7,20.9 20.9,20.7 23.95,20.7 25.8,22.55 C38.1
  Top 0.2: C38.1 27.15,22.2 27.4,22.2 27.8,21.8 29,21.8 29.33,21.48 29.33,20.25 v29.48,20.1 | v24.65,18.38 24.83,18.2 25.22,18.2 26.18,17.24 29.37,17.24 v29.37,16.99 29.33,16.95 29.33,16.45 C39.1
  Top 0.3: L1.1 29.52,11.25 v31.38,11.25
  Bottom 0.2: v29.48,20.1 29.65,19.93 29.65,16.99 v29.37,16.99 29.69,16.99 31.75,14.94 31.75,13 30.88,12.12 30.1,12.12
  Bottom 0.3: C7.1 30.1,12.75 30.1,12.12 30.1,11.2 | 30.1,11.2 IC3.4 | v31.38,11.25 30.15,11.25 30.1,11.2
3V3  (via drill 0.3)
  Top 0.125: IC1.J11 IC1.H11 16.7,24.7 16.7,29.62 17.4,30.33 17.4,31.05 C35.1 | IC1.P10 22.3,23.9 23.98,23.9 25.98,25.9 RN2.3 | RN2.3 26.8,25.9 26.8,25.83 27.02,25.83 RN2.4 | IC1.L6 19.9,19.9 23.88,19.9 24.7,20.72 26.26,20.72 27.01,21.47 v27.26,21.47 | RN2.3 RN2.2 RN2.1
  Top 0.2: v3.5,29.52 3.5,26.9 | C35.1 17.62,31.23 17.18,31.23 16.98,31.42 16.98,33.45 17.5,33.98 v17.6,33.98 | v24.98,33.73 25.33,33.73 26.77,32.27 26.77,30.27 27.1,29.95 28.6,29.95 v28.85,29.7 28.85,28.35 | RN2.1 27.02,27.95 27.42,28.35 28.85,28.35 | U9.8 30.4,28.35 28.85,28.35
  Top 0.3: C30.1 2.1,26.9 3.5,26.9 4.8,26.9 Q1.P$1 | Q1.P$1 4.7,26.42 4.7,24.62 | 4.7,24.62 4.7,23.05 U2.5 | C18.1 4.7,24.62 | Q1.P$1 Q1.P$4
  Bottom 0.2: v3.5,29.52 3.5,29.77 4.95,31.23 4.95,32.46 7.04,34.55 17.02,34.55 v17.6,33.98 17.88,33.7 19.65,33.7 19.93,33.98 24.73,33.98 v24.98,33.73 | R4.1 28.85,30.75 v28.85,29.7 30.15,29.7 32.83,27.02 32.83,23.77 31.75,22.7 31.75,22.12 | JP1.7 31.75,20.25 31.75,22.12 | C17.1 27.4,22.12 | 27.4,22.12 27.4,21.61 v27.26,21.47 | 31.75,22.12 27.4,22.12
CAM_EXTCLK  (via drill 0.3)
  Top 0.125: v9.9,15.6 10.65,16.35 10.65,16.7 11.05,17.1 IC1.A2
  Bottom 0.2: U$2.P$31 9.95,15.65 v9.9,15.6
CAM_FRAME_VALID  (via drill 0.3)
  Top 0.125: v23.38,30.67 22.23,29.52 20.98,29.52 20.3,28.85 IC1.M16
  Bottom 0.15: v23.38,30.67 22.68,29.98 22.68,23.48 U$2.P$7
CAM_LINE_VALID  (via drill 0.3)
  Top 0.125: IC1.N16 21.1,28.85 21.5,29.25 22.73,29.25 24.23,30.75 v24.23,31.17
  Bottom 0.15: v24.23,31.17 24.23,30.7 22.95,29.42 22.95,24.71 23.98,23.68 23.98,22.77 23.85,22.65 U$2.P$8
CAM_PIXCLK  (via drill 0.3)
  Top 0.125: v9.9,16.45 10,16.45 10.65,17.1 10.65,17.55 11,17.9 IC1.A3
  Bottom 0.2: U$2.P$32 10,16.35 v9.9,16.45
CAM_RESET_BAR  (via drill 0.3)
  Top 0.125: IC1.R16 23.1,28.7 23.1,28.85 24.15,29.9 25.15,29.9 v25.33,29.73
  Bottom 0.15: U$2.P$16 23.95,17.05 24.58,16.43 25.33,16.43 25.77,16.88 25.77,20.11 25.38,20.51 25.38,24.26 24.32,25.31 24.32,27.97 25.33,28.97 v25.33,29.73
CAM_SCLK  (via drill 0.3)
  Top 0.125: v22.43,31.93 22.43,31.63 21.88,31.08 21.88,30.38 21.77,30.27 20.52,30.27 19.1,28.85 19.1,27.9 IC1.L15
  Bottom 0.2: U$2.P$4 19.95,25.95 21.73,27.73 21.73,31.23 v22.43,31.93
CAM_SDATA  (via drill 0.3)
  Top 0.125: v23.27,31.92 23.23,31.92 22.12,30.83 22.12,30.27 21.88,30.02 20.63,30.02 19.5,28.9 IC1.L16
  Bottom 0.2: U$2.P$5 20.65,26.15 22.05,27.55 22.05,30.7 v23.27,31.92
CAM_STROBE  (via drill 0.3)
  Top 0.125: v24.67,31.9 24.95,31.62 24.95,31.08 22.88,29 22.15,29 21.9,28.75 IC1.P16
  Bottom 0.15: v24.67,31.9 24.95,31.62 24.95,31 23.23,29.27 23.23,24.84 24.25,23.82 24.25,22.15 24.05,21.95 U$2.P$9
CAM_TRIGGER  (via drill 0.3)
  Top 0.125: IC1.P15 22.3,27.1 23.98,27.1 24.23,27.35 24.23,28.67 v24.48,28.92
  Bottom 0.15: v24.48,28.92 24.05,28.5 24.05,25.2 25.1,24.15 25.1,20.4 25.5,20 25.5,17 25.2,16.7 24.7,16.7 24.2,17.2 24.2,17.5 23.95,17.75 U$2.P$15
CAMDOUT0  (via drill 0.3)
  Top 0.125: v9.9,17.3 10,17.3 10.65,17.95 10.65,18.35 11,18.7 IC1.A4
  Bottom 0.2: U$2.P$33 10.15,17.05 v9.9,17.3
CAMDOUT1  (via drill 0.3)
  Top 0.125: v9.9,18.15 10.05,18.15 10.6,18.7 10.6,19.15 10.95,19.5 IC1.A5
  Bottom 0.2: U$2.P$34 10.5,17.75 10.1,18.15 v9.9,18.15
CAMDOUT2  (via drill 0.3)
  Top 0.125: v9.9,19 10.05,19 10.6,19.55 10.6,20 10.9,20.3 IC1.A6
  Bottom 0.2: U$2.P$35 10.65,18.45 10.1,19 v9.9,19
CAMDOUT3  (via drill 0.3)
  Top 0.125: v9.9,19.85 11.15,21.1 IC1.A7
  Bottom 0.2: U$2.P$36 10.75,19.15 10.05,19.85 v9.9,19.85
CAMDOUT4  (via drill 0.3)
  Top 0.125: v9.9,20.7 11.1,21.9 IC1.A8
  Bottom 0.2: U$2.P$37 10.85,19.85 10,20.7 v9.9,20.7
CAMDOUT5  (via drill 0.3)
  Top 0.125: v9.9,21.55 9.9,21.7 10.9,22.7 IC1.A9
  Bottom 0.2: U$2.P$38 11,20.55 10,21.55 v9.9,21.55
CAMDOUT6  (via drill 0.3)
  Top 0.125: IC1.A10 10.35,23.5 v9.9,23.05
  Bottom 0.2: U$2.P$40 10.85,21.95 9.9,22.9 v9.9,23.05
CAMDOUT7  (via drill 0.3)
  Top 0.125: IC1.A11 10.8,24.3 10.3,23.8 v9.5,23.8
  Bottom 0.2: U$2.P$41 10.8,22.65 10.5,22.95 10.5,23.3 10.1,23.7 9.6,23.7 v9.5,23.8
CAMDOUT8  (via drill 0.3)
  Top 0.125: v10.1,24.45 10.75,25.1 IC1.A12
  Bottom 0.2: U$2.P$42 10.95,23.35 10.1,24.2 v10.1,24.45
CAMDOUT9  (via drill 0.3)
  Top 0.125: v9.5,25.9 IC1.A13
  Bottom 0.2: U$2.P$43 13.65,25.95 13.4,26.2 11.05,26.2 10.75,25.9 v9.5,25.9
CAMDOUT10  (via drill 0.3)
  Top 0.125: IC1.A14 10.3,26.7 v10.1,26.5
  Bottom 0.2: U$2.P$44 14.35,25.95 13.75,26.55 10.15,26.55 v10.1,26.5
CAMDOUT11  (via drill 0.3)
  Top 0.125: v9.25,26.75 9.55,27.05 10.45,27.05 10.9,27.5 IC1.A15
  Bottom 0.2: U$2.P$45 15.05,25.95 14.1,26.9 10.9,26.9 10.7,27.1 9.6,27.1 v9.25,26.75
GND  (via drill 0.3, 0.35)
  Top 0.125: IC1.D15 13.5,27.9 12.7,27.9 | IC1.H10 IC1.G10 15.9,23.5 | IC1.H9 IC1.H8 IC1.J8 | IC1.G8 15.9,21.9 | 15.9,21.9 IC1.F8 IC1.F9 15.9,23.1 15.9,23.5 | IC1.H9 IC1.J9 | IC1.J9 IC1.J8 | IC1.J8 IC1.K8 | IC1.K8 IC1.K9 | IC1.K8 IC1.K7 IC1.K6 19.1,19.9 19.1,19.3 19.3,19.1 23.5,19.1 | IC1.D2 13.9,17.5 | 11.9,17.5 11.9,16.3 | 12.7,17.5 11.9,17.5 | 12.7,17.5 13.9,17.5 | 15.9,21.9 15.9,19.9 | 11.9,20.7 12.7,20.7 | 12.7,20.7 12.7,23.1 | 12.7,23.1 12.7,25.5 | 12.7,25.5 12.7,27.9 | 12.7,20.7 12.7,19.9 | 12.7,19.9 12.7,17.5 | 12.7,19.9 15.9,19.9 | 11.9,17.5 11.9,20.7 | 12.7,27.9 12.7,28.9 11.5,28.9 IC1.A16 10.25,28.3 v9.9,27.95 | 13.9,17.5 15.7,17.5 15.9,17.7 15.9,19.9 | 12.7,23.1 11.9,23.1 11.9,20.7 | IC1.A1 11.9,16.3 | v10.1,25.3 10.3,25.5 12.7,25.5 | 11.9,16.3 11.9,15.4 11.5,15 9.3,15 9.3,21.5 6.28,21.5 C18.2 | IC1.R10 22.3,23.1 21.5,23.1 | IC1.T12 23.5,25.5 | 23.5,25.5 21.7,25.5 21.5,25.3 21.5,23.5 | 21.5,23.5 21.5,23.1 | IC1.N10 21.5,23.5 | IC1.H10 IC1.J10 | IC1.K9 IC1.K10 IC1.J10 | IC1.K9 IC1.J9 | IC1.J10 IC1.J9 | IC1.H9 IC1.H10 | 21.5,23.1 20.1,23.1 19.9,23.3 19.9,27.1 | 19.9,27.1 20.7,27.1 IC1.N15 21.5,27.9 23.1,27.9 IC1.T16 23.85,28.65 23.85,29.25 24.15,29.55 24.7,29.55 25.2,29.05 25.6,29.05 25.92,29.38 v25.92,30.33 25.92,32.38 25.15,33.15 23.85,33.15 | 15.9,23.5 15.9,29.3 | 19.9,27.1 19.9,28.85 20.82,29.77 22.05,29.77 22.38,30.1 22.38,30.5 23.15,31.27 23.5,31.27 24.05,31.83 v24.05,32.48 | v20.6,12.15 20.7,12.25 20.7,16.7 IC1.N2 | 23.5,19.1 IC1.T5 23.85,19.5 23.93,19.57 | v28.42,21.18 28.12,20.88 26.77,20.88 26.35,20.45 26,20.45 | 26,20.45 24.8,20.45 23.93,19.57 | IC1.H16 17.1,29.65 17.7,30.25 18.5,30.25 18.62,30.38 | 23.5,19.1 23.93,19.1 23.93,19.57
  Top 0.125: v29,18.57 28.55,18.12 26.67,18.12 26,18.8 26,20.45 | 23.5,25.5 24.07,25.5 v25.17,26.6
  Top 0.15: v24.05,32.48 23.85,32.67 23.85,33.15 23.85,34.5 23.75,34.5 | C12.2 C29.2 18.62,32.75 C35.2 | v18.45,34.33 19.2,34.33 19.38,34.5
  Top 0.2: 18.62,30.38 18.62,32.75 | v8.35,13.27 8.35,10.25 8.6,10 12.25,10 13.2,10.95 v14.2,10.95 | 19.6,32.75 C29.2 19.45,34.25 v19.38,34.33 19.38,34.5 23.75,34.5 | C35.2 18.55,32.75 18.55,34.33 18.5,34.33 | 18.5,34.33 v18.45,34.33 | C32.2 5.1,11.45 5.1,12.3 1.65,12.3 | U2.2 2.88,22.1 2.88,25.88 v3.12,25.88 | 1.65,12.3 C3.2 1.65,13.9 2.9,13.9 v2.9,15.3 | 1.65,12.3 C9.2 1.65,10.5 3.1,10.5 3.1,8.9 U1.2 | C39.2 29.52,14.55 27.9,14.55 C11.2 | C1.2 16.02,32.77 16.02,34.6 18.5,34.6 18.5,34.33
  Bottom 0.125: IC2.E5 6.55,12.75 7.8,12.75 8.32,13.27 v8.35,13.27 | IC2.B3 3.85,10.45 2.85,10.45 IC2.C1 1.85,10.95 1.85,10.35 | D10.3 v17.5,7.3 | 26.05,17.85 28.85,17.85 28.88,17.88 28.88,20.73 v28.42,21.18 | 26.6,23.88 26.6,21 26.05,20.45 26.05,17.85 | C17.2 27.4,23.88 | U$2.P$17 24,16.35 24,16.15 | 26.05,17.85 26.05,16.15 24,16.15 | 24,16.15 24,14.85 v23.75,14.6 23.75,12.1 v23.6,12.1 20.6,12.1 v20.6,12.15 20.6,12.65 | 20.6,12.65 19.95,12.65 | 19.25,12.65 v18.98,12.65 | U$2.P$22 19.25,12.65 | U$2.P$20 20.65,12.65 20.6,12.65 | U$2.P$21 19.95,12.65 | 19.95,12.65 19.25,12.65
  Bottom 0.15: v24.05,32.48 24.02,32.5 C14.2 | v18.45,34.33 20.5,34.33
  Bottom 0.2: 18.55,22.5 U$2.P$2 | 16.45,22.5 15.75,22.5 U$2.P$46 15.75,25.95 14.45,27.25 11.05,27.25 10.65,27.65 C23.2 | 18.55,22.5 16.45,22.5 | U$2.P$3 19.25,22.5 | U$2.P$26 16.45,22.5 | U$2.P$22 19.25,16.35 | 19.25,16.35 19.25,21.25 | 19.25,21.25 19.25,22.5 | 19.25,22.5 18.55,22.5 | U$2.P$21 19.95,16.35 | 19.95,16.35 19.25,16.35 | U$2.P$20 20.65,16.35 | 20.65,16.35 19.95,16.35 | 19.25,21.25 U$2.P$10 | 19.25,22.5 20.45,22.5 21.35,23.4 U$2.P$6 21.35,26.35 22.38,27.38 22.38,30.52 23.12,31.27 23.5,31.27 24.05,31.83 v24.05,32.48 | U$2.P$17 20.65,16.35 | v9.9,27.95 9.48,27.95 8.95,28.48 C27.2 | 1.85,10.35 1.85,7.28 7.32,7.28 9.8,9.75 11.75,9.75 12.95,10.95 v14.2,10.95 | v25.92,30.33 25.92,31.75 | 25.92,31.75 27.85,31.75 | 27.85,31.75 27.85,29.6 | 27.85,29.6 27.85,29.05 v28.02,29.05 30.34,29.05 32.48,26.91 32.48,23.93 32.05,23.5 X1.5 28.55,23.5 28.17,23.88 27.4,23.88 26.6,23.88 25.96,23.88 25.96,24.5 25.17,25.29 v25.17,26.6 24.92,26.85 24.92,27.75 26.77,29.6 27.85,29.6 | 27.85,31.75 30.58,31.75 v30.58,31.9 | v30.58,31.9 30.58,34.02 | 30.58,34.02 v30.8,34.02 | v30.58,31.9 30.58,30.55 v31.77,30.55 | v19.38,34.33 20.5,34.33 26.1,34.33 | 26.1,34.33 30.58,34.33 30.58,34.02 | 25.92,31.75 25.92,33.27 26.15,33.5 26.15,34.27 26.1,34.33
  other vias: 10.7,15.05 4.07,34.17 7.5,21.7 5.9,21.1 5.5,18.1 5.1,19.7 8.1,17.5 8.3,15.9 7.1,15.9 4.5,16.1 6,27.42 2.47,29.83 0.93,31 4.2,31.48 34.05,30.62 3.12,7.5 8.62,21.25 7.65,22.82 33.62,24.2 24.4,10 11.8,7.3 3.6,4.4 0.7,4.4 21.55,4.15 8.8,1 9,3.9 25.85,0.85 6.5,3.3 9.15,6 4.9,6.3 5.05,22.1 11.1,31.92 9.93,31.83 33.48,26.25 31.75,15.88 31.75,17.12 32,19 32.88,20.12 26.75,13.62 25.25,13.88
  pour Bottom (isolate 0.15, rank 3): -0.5,35.5 35.5,35.5 35.5,-0.5 -0.5,-0.5
  pour Top (isolate 0.15): -1.5,36.5 36.5,36.5 36.5,-1.5 -1.5,-1.5
  cutout Bottom: 18.5,24.9 19.3,24.9 19.3,24.5 18.5,24.5
  cutout Bottom: 18.9,14.5 20.9,14.5 20.9,14.1 18.9,14.1
GPIO0
  Top 0.125: IC1.T4 24.1,18.7 24.32,18.93 24.92,18.93 26.31,17.54 29.6,17.54 30.19,16.95 30.6,16.95 31.05,16.5 JP1.6
GPIO1
  Top 0.125: IC1.T3 23.82,17.9 24.5,17.82 25.19,17.82 26.06,16.95 28.62,16.95 28.85,16.71 28.85,15.38 29.12,15.1 31.4,15.1 32,14.5 JP1.5
GPIO2  (via drill 0.3)
  Top 0.125: IC1.T2 23.92,17.1 24.58,16.45 24.58,15.75 v24.83,15.5
  Top 0.2: v31.15,14.5 33.15,12.5 JP1.4
  Bottom 0.2: v24.83,15.5 30.15,15.5 v31.15,14.5
GPIO3  (via drill 0.3)
  Top 0.125: v24.62,14.54 24.25,14.91 24.25,16.4 23.95,16.7 23.1,16.7 IC1.R2
  Top 0.2: v31.15,13.5 31.75,12.9 31.75,12.25 JP1.3
  Bottom 0.2: v24.62,14.54 24.88,14.54 25.5,15.16 29.48,15.16 v31.15,13.5
INITN
  Top 0.125: IC1.T9 24.03,22.7 25.63,24.3 27.67,24.3 27.92,24.56 27.92,26.4 28.1,26.58 28.45,26.58 RN2.7
JTAG_TCK  (via drill 0.3)
  Top 0.125: IC1.T10 24.1,23.5 25.83,25.23 v26.08,25.23
  Top 0.2: RN2.8 29.15,27.5 30.35,26.3 31.25,26.3 v31.65,26.7
  Bottom 0.2: v26.08,25.23 26.58,25.73 28.08,25.73 28.33,25.48 28.33,24.92 28.75,24.5 X1.4 31.1,24.5 31.3,24.7 31.3,26.35 v31.65,26.7
JTAG_TDI  (via drill 0.3)
  Top 0.125: IC1.R11 23.1,24.7 24.05,24.7 25.9,26.55 v25.9,27.02
  Bottom 0.2: v25.9,27.02 26.88,26.05 28.23,26.05 28.77,25.5 X1.3
JTAG_TDO  (via drill 0.3)
  Top 0.125: IC1.M10 20.7,23.9 20.7,26.1 20.9,26.3 24.1,26.3 25.67,27.88 v25.9,27.88
  Bottom 0.2: v25.9,27.88 26.02,27.88 27.4,26.5 X1.2
JTAG_TMS  (via drill 0.3)
  Top 0.125: IC1.T11 24.02,24.3 26.44,26.72 26.44,28.24 v27.12,28.92
  Bottom 0.2: v27.12,28.92 27.12,28.2 27.83,27.5 X1.1
LED1A
  Bottom 0.2: 10.63,6.12 R11.2
  Bottom 0.3: J1.9 10.63,6.12
LED1K
  Top 0.125: IC1.L2 19.1,16.7 19.1,14.57 18,13.47 18,11.93 17.48,11.41 16.17,11.41 13.07,8.31 J1.10
LED2A  (via drill 0.3)
  Top 0.125: IC1.P1 21.9,15.3 22.68,14.52 22.68,11.27 v22.3,10.9
  Bottom 0.3: J1.11 22.46,8.71 22.46,10.74 v22.3,10.9
LED2K
  Bottom 0.3: R2.2 24.92,7.73 J1.12
MCLK
  Top 0.125: IC1.B16 11.9,27.9 10.9,27.9 10.35,27.35 9.5,27.35 9.25,27.6 9.25,28.4 8.75,28.9 7.4,28.9 Q1.P$3
N$1
  Top 0.3: C15.1 U1.4
N$2
  Top 0.2: C13.1 4.05,19.52 4.05,21.15 U2.4
N$3  (via drill 0.3)
  Top 0.3: v31.38,9.25 29.27,9.25 L1.2
  Bottom 0.3: IC3.5 30.3,9.25 v31.38,9.25
N$4  (via drill 0.3)
  Top 0.125: v23.3,10.9 22.93,11.27 22.93,14.68 22.7,14.9 IC1.R1
  Bottom 0.3: R2.1 23.23,10.82 v23.3,10.9
N$5
  Bottom 0.2: IC3.3 26.95,11.2 26.75,11 26.75,9.5 26.95,9.3 IC3.1
  Bottom 0.3: IC3.1 28,9.3 28,7.5 C21.1 R1.1
N$6
  Top 0.2: U8.3 12.43,29.9 12.23,29.7 10.73,29.7 10.52,29.9 U8.1
  Top 0.3: R3.1 7.32,31.17 7.6,30.9 C31.1 10.52,30.9 U8.1
N$8  (via drill 0.3)
  Top 0.125: IC1.L1 19.5,15.52 19.35,15.38 19.35,14.47 18.25,13.37 18.25,11.82 17.58,11.15 16.27,11.15 14.02,8.9 14.02,7.4 v13.62,7
  Bottom 0.2: R11.1 12.35,6.35
  Bottom 0.3: 12.35,6.35 13.3,6.35 13.62,6.68 v13.62,7
N$9
  Bottom 0.3: R5.1 19.57,1.3 20.04,1.77 J1.2
N$10
  Top 0.3: C26.1 14,32.53 12.8,32.53 12.43,32.91 U8.4
N$15  (via drill 0.3)
  Top 0.2: v12.9,4.57 12.93,4.55 14.43,4.55 14.93,4.05 14.93,1.47 v15.1,1.3
  Bottom 0.2: 11.91,4.78 12.7,4.78 v12.9,4.57 | R5.2 v15.1,1.3
  Bottom 0.25: 11.91,4.78 8.77,4.78 8.1,4.1 8.1,1.45 7.6,0.95 D3.A
PCSN  (via drill 0.3)
  Top 0.125: IC1.N8 21.5,21.5 23.89,21.5 25.94,23.55 32.3,23.55
  Top 0.2: U9.1 30.4,21.16 31.1,20.45 32.15,20.45 32.3,20.6 32.3,23.55 32.3,23.7 v31.75,24.25 | RN2.6 29.38,25.9 29.67,25.6 31.9,25.6 v31.9,25.9
  Bottom 0.2: v31.9,25.9 31.9,24.4 v31.75,24.25
PMISO
  Top 0.125: U9.2 31.66,23.12 31.49,23.3 26.04,23.3 25.7,22.96 25.7,22.8 24,21.1 IC1.T7
PMOSI
  Top 0.125: IC1.T8 23.94,21.9 25.84,23.8 29.05,23.8 30.2,24.95 33.27,24.95 34.16,25.83 34.16,28.5 U9.5
PROGRAMN  (via drill 0.3)
  Top 0.125: IC1.R9 23.1,23.1 24.07,23.1 25.52,24.55 27.49,24.55 27.67,24.74 27.67,27.73 28,28.05 29.01,28.05 29.96,27.1 30.88,27.1 31.05,27.27 31.05,29.83 29.88,31 29.88,32.5 v29.88,32.65
  Top 0.2: C42.1 29.77,32.6 29.88,32.5
  Bottom 0.2: v29.88,32.65 28.75,32.65 R4.2 R9.2
PSCK
  Top 0.125: IC1.N9 21.5,22.3 23.98,22.3 25.73,24.05 28.85,24.05 29.3,24.5 29.3,25.1
  Top 0.2: U9.6 32.84,28.45 32.84,25.71 32.4,25.27 29.88,25.27 29.7,25.1 29.3,25.1 RN2.5
RAMCE  (via drill 0.3)
  Top 0.125: IC1.G1 16.3,14.3 14.46,12.46 v14.46,12.06
  Bottom 0.125: IC2.A3 5.1,8.2 7.35,8.2 9.49,10.33 11.29,10.33 13.01,12.06 v14.46,12.06
RAMCLK  (via drill 0.3)
  Top 0.125: IC1.H2 16.7,16.7 16.7,14.34 15.27,12.91 v15.27,12.31
  Bottom 0.125: IC2.B2 3.8,9.5 3.8,8.6 4.65,7.75 7.26,7.75 9.59,10.08 11.39,10.08 12.82,11.51 14.94,11.51 15.27,11.83 v15.27,12.31
RAMD0  (via drill 0.3)
  Top 0.125: v10.9,11.97 11,11.97 11.55,11.42 12,11.42 14.7,14.12 IC1.E1
  Bottom 0.125: IC2.D3 4.85,12.45 4.85,13.5 5.28,13.93 8.58,13.93 9.95,12.55 10.32,12.55 v10.9,11.97
RAMD1  (via drill 0.3)
  Top 0.125: v10.41,13.36 10.72,13.05 12.2,13.05 13.1,13.95 IC1.C1
  Bottom 0.125: IC2.D2 3.9,12.5 3.9,13.4 4.93,14.43 8.8,14.43 9.86,13.36 v10.41,13.36
RAMD2  (via drill 0.3)
  Top 0.125: IC1.F1 15.5,14.22 11.86,10.57 10.57,10.57 v10.27,10.88
  Bottom 0.125: IC2.C4 5.85,10.45 7.3,10.45 8.01,11.16 9.99,11.16 v10.27,10.88
RAMD3  (via drill 0.3)
  Top 0.125: v10.05,11.98 10.6,12.53 12.39,12.53 13.9,14.04 IC1.D1
  Bottom 0.125: IC2.D4 5.85,12.45 8.05,12.45 8.27,12.67 9.47,12.67 10.05,12.08 v10.05,11.98
RAMD4  (via drill 0.3)
  Top 0.125: IC1.C2 13.5,16.7 13.5,13.99 12.31,12.8 9.9,12.8 v9.23,12.12
  Bottom 0.125: v9.23,12.12 9.15,12.2 8.15,12.2 7.9,11.95 IC2.D5
RAMD5  (via drill 0.3)
  Top 0.125: IC1.E2 14.3,16.7 14.3,14.09 12.2,11.99 v11.76,11.99
  Bottom 0.125: IC2.E3 4.35,13.4 5.12,14.18 8.68,14.18 10.04,12.81 11.26,12.81 11.76,12.31 v11.76,11.99
RAMD6  (via drill 0.3)
  Top 0.125: IC1.B2 12.7,16.7 12.7,13.9 12.12,13.32 11.52,13.32 v11.24,13.6
  Bottom 0.125: IC2.E2 3.35,13.45 4.57,14.68 8.92,14.68 9.69,13.9 10.94,13.9 v11.24,13.6
RAMD7  (via drill 0.3)
  Top 0.125: v12,13.98 12.3,14.27 IC1.B1
  Bottom 0.125: IC2.E1 2.35,13.3 3.97,14.93 9.02,14.93 9.8,14.15 11.82,14.15 v12,13.98
RAMDQSDM  (via drill 0.3)
  Top 0.125: IC1.F2 15.1,16.7 15.1,14.17 12.05,11.12 v11.07,11.12
  Bottom 0.125: v11.07,11.12 10.77,11.43 4.97,11.43 4.5,10.95 IC2.C3
RAMRESET  (via drill 0.3)
  Top 0.125: IC1.G2 15.9,16.7 15.9,14.26 11.96,10.32 9.25,10.32 v8.98,10.6
  Bottom 0.125: IC2.A4 5.85,8.45 7.25,8.45 8.98,10.18 v8.98,10.6
SELFRESET  (via drill 0.3)
  Top 0.125: v26,21.3 24.92,21.3 23.93,20.3 IC1.T6
  Bottom 0.15: v26,21.3 25.65,21.65 25.65,24.38 24.6,25.43 24.6,27.85 26.6,29.85 26.6,30.5 R9.1
TA1  (via drill 0.3)
  Top 0.125: v18.77,10.1 18.77,10.38 19.25,10.85 20.53,10.85 21.5,11.82 21.5,16.7 IC1.P2
  Bottom 0.125: D10.10 18.5,9.82 v18.77,10.1
  Bottom 0.15: D10.1 D10.10
  Bottom 0.2: D10.1 18.5,6.9 18,6.4 J1.4
TA2  (via drill 0.3)
  Top 0.125: v17.93,10.1 17.98,10.1 18.98,11.1 20.43,11.1 21.25,11.93 21.25,15.15 21.1,15.3 IC1.N1
  Bottom 0.125: D10.9 18,10.02 v17.93,10.1
  Bottom 0.15: D10.2 D10.9
  Bottom 0.2: D10.2 18,7.6 18.1,7.5 18.1,7.02 J1.5
TA3  (via drill 0.3)
  Top 0.125: v16.23,10.1 17.02,10.9 18.05,10.9 19.9,12.75 19.9,16.7 IC1.M2
  Bottom 0.125: D10.6 16.5,9.82 v16.23,10.1
  Bottom 0.15: D10.5 D10.6
  Bottom 0.2: J1.7 16.5,7.46 D10.5
TA4  (via drill 0.3)
  Top 0.125: v17.07,10.1 17.07,10.3 17.43,10.65 18.15,10.65 20.15,12.65 20.15,15.35 20.3,15.5 IC1.M1
  Bottom 0.125: D10.7 17,10.02 v17.07,10.1
  Bottom 0.15: D10.4 D10.7
  Bottom 0.2: D10.4 17,7.6 16.9,7.5 16.9,7.3 15.98,6.38 15.98,5.12 14.22,3.36 J1.8
VBUS  (via drill 0.35)
  Top 0.125: IC1.J7 IC1.J6 17.5,19.9 17.5,18.5 17.7,18.3 18.1,18.3 18.3,18.1 18.3,17.5 | 18.3,17.5 18.3,14.12 17.38,13.2 v17.38,12.27 | C11.1 26.2,15.15 25.52,15.15 25.4,15.27 25.4,16.02 23.93,17.5 18.3,17.5
  Top 0.2: U1.5 4.36,9.25 4.8,8.8 9.27,8.8 9.82,9.35 13.7,9.35 16.05,11.7 16.8,11.7 v17.38,12.27
  Top 0.3: U1.5 4.46,9.95 4.46,11.2 4.15,11.5 C9.1
VCAMAA  (via drill 0.3)
  Top 0.2: v14.25,33.3 14.25,33.5 13.7,34.05 11.12,34.05 10.52,33.45 U8.5 | v8.7,27.62 8.67,27.59 v8.67,22.3
  Top 0.3: U8.5 10.52,33.53 8.5,33.53 v8.4,33.63 7.45,33.63 C25.1
  Bottom 0.2: U$2.P$48 17.15,26.2 | 17.15,26.2 17.85,26.2 U$2.P$1 17.85,27.05 18.77,27.98 18.77,29.25 C4.1 | 17.85,12.9 U$2.P$24 | C8.1 19.9,9.55 19.9,10.57 18.35,12.12 18.35,12.9 | 17.15,26.2 16.73,26.2 15.01,27.92 14.48,27.92 14.25,28.15 14.25,33.2 14.2,33.25 v14.25,33.3 | 17.85,12.9 17.15,12.9 | 17.15,12.9 13.05,12.9 12.6,13.35 12.6,14.27 12.31,14.56 11.63,14.56 11.5,14.44 9.92,14.44 9.3,15.06 9.3,21.67 v8.67,22.3 | v8.7,27.62 6.68,27.62 5.7,28.6 5.7,32.18 7.15,33.63 v8.4,33.63 | U$2.P$25 17.15,12.9 | U$2.P$23 18.55,13.1 18.35,12.9 | 18.35,12.9 17.85,12.9
VCAMCORE  (via drill 0.3)
  Top 0.2: v24.65,19.52 24.73,19.52 26.43,17.82 30.67,17.82 C24.1 | v13.42,29.3 13.52,29.4 14.57,29.4 14.85,29.68 14.85,33.33 15.15,33.62 v15.43,33.62
  Bottom 0.15: v15.43,33.62 16.02,33.62 16.3,33.35 16.75,33.35 17.1,33 17.1,32.5 17.45,32.15 19.7,32.15 19.9,32.35 19.9,33 20.23,33.33 21.77,33.33 22.32,32.77 22.93,32.77 23.2,33.05 24.33,33.05 25.35,32.03 25.35,31 23.5,29.15 23.5,24.96 24.55,23.91 24.55,19.9 24.5,19.85
  Bottom 0.2: U$2.P$12 24.5,19.85 24.55,19.85 24.55,19.62 v24.65,19.52 | U$2.P$47 16.45,25.95 14.8,27.6 12.9,27.6 12.35,28.15 C23.1 12.6,29.25 12.6,29.3 | C6.1 12.4,30.75 12.4,29.3 12.6,29.3 | v13.42,29.3 12.6,29.3
  Bottom 0.3: C6.1 12.25,30.8 U4.5
VCAMIO  (via drill 0.3)
  Top 0.125: IC1.F6 IC1.F7 15.1,21.5 15.1,23.1 IC1.F10 IC1.F11 15.1,24.7 15.1,29.45 15.48,29.83 15.48,30.52 C1.1 | IC1.L11 19.1,24.3 | IC1.K11 19.1,24.3 | 19.1,24.3 19.1,25.3 18.9,25.5 18.5,25.5 18.3,25.7 18.3,28.85 18.75,29.3 19.15,29.3 20.9,31.05 C12.1
  Top 0.2: C40.1 25.9,16.25 25.9,16.5 25.12,17.27 v24.92,17.27 | v22.6,33.38 22.6,33.12 21.82,32.35 21.82,31.5 21.68,31.35 21.05,31.35 C12.1 | C1.1 15.8,31.25 16.45,31.25 16.65,31.45 v16.65,33.95
  Bottom 0.15: v22.6,33.38 24.4,33.38 25.62,32.15 25.62,30.88 23.77,29.02 23.77,25.08 24.83,24.02 24.83,20.27 25.23,19.88 25.23,18.95 | v24.92,17.27 25.23,17.57 25.23,18.95 | U$2.P$13 24.05,19.15 24.25,18.95 25.23,18.95
  Bottom 0.2: 21.2,19.15 21.2,18.65 21.4,18.45 U$2.P$14 | U$2.P$13 21.2,19.15 | 21.2,19.15 21.2,20.3 21.45,20.55 U$2.P$11 | U$2.P$39 10.8,21.25 10.5,21.55 10.5,21.8 10,22.3 v9.5,22.3 9.3,22.5 9.3,23.12 8.88,23.55 7.9,23.55 C22.1 7.9,24.2 7.2,24.2 7,24.4 7,26.35 6.55,26.8 5.32,26.8 | U5.5 4.05,26.8 | 4.05,26.8 5.32,26.8 | C10.1 4.05,28.2 4.05,26.8 | 5.32,26.8 5.32,32.33 7.22,34.23 16.38,34.23 v16.65,33.95 17.23,33.38 19.8,33.38 20.07,33.65 22.32,33.65 v22.6,33.38
VCCAUX  (via drill 0.3)
  Top 0.125: IC1.G11 16.7,23.9 18.3,23.9 | IC1.L7 19.1,21.5 19.1,23.7 18.9,23.9 18.3,23.9 | 18.3,23.9 18.3,24.5 18.1,24.7 17.7,24.7 17.5,24.9 17.5,29 v18,29.5
  Top 0.2: C29.1 19.45,30.1 19,29.65 18.15,29.65 v18,29.5
  Bottom 0.2: U6.5 18.2,30.85 18.2,29.7 v18,29.5
  Bottom 0.3: C14.1 20.85,30.85 U6.5
VIN  (via drill 0.3, 0.35)
  Top 0.2: U2.1 0.8,23.05 | 0.8,21.15 U2.3 | 3.9,17.36 3.9,18.3 3.7,18.5 1.95,18.5 | 0.8,18.5 1.95,18.5 | U3.3 1.95,18.5 | 3.85,17.05 3.96,16.95 5.7,16.95 C2.1 | v13.57,5.4 13.57,5.25 13.95,4.88 v25.98,4.88
  Top 0.3: 3.9,17.36 U3.1 3.85,17.05 | 0.8,24.7 v1.05,24.7 C37.1 | 0.8,24.7 0.8,23.05 0.8,21.15 0.8,18.5 0.8,9.85 | C5.1 0.8,6.3 | 0.8,9.85 0.8,7.95 | 0.8,7.95 0.8,6.3 | 0.8,24.7 0.8,29.48 1.88,30.55 5.62,30.55 | v6.3,30.65 6.2,30.55 5.62,30.55 | 0.8,6.3 0.8,5.6 1.03,5.38 6.38,5.38 D1.C 7.6,5.25 v7.9,5.55 | U1.1 0.8,9.85 | U1.3 0.8,7.95 | C16.1 27.9,5.95 26.25,5.95 25.98,5.68 v25.98,4.88 | R3.2 5.62,30.55
  Bottom 0.2: U5.1 4.05,23.55 | 5.8,23.55 C19.1 | 2.15,20.38 C20.1 | U6.1 14.85,30.85 | v6.3,30.65 6.3,32.25 6.75,32.7 U4.3 7.74,32.8 8.49,32.8 9.59,33.9 14.5,33.9 14.85,33.55 14.85,32.75 | 14.85,30.85 14.85,32.75 | C36.1 14.85,29.25 14.85,30.85 | 14.85,32.75 U6.3
  Bottom 0.3: 5.8,23.55 4.05,23.55 | U5.3 2.15,22.6 | U5.1 4.05,22.9 3.75,22.6 2.15,22.6 | 2.15,22.6 2.15,20.38 | 2.15,22.6 1.5,22.6 1.05,23.05 v1.05,24.7 | C27.1 7.45,29.45 7.45,30.6 U4.1 6.45,30.8 v6.3,30.65 | D1.C 6.8,5.55 v7.9,5.55 8.25,5.2 13.38,5.2 v13.57,5.4 | R1.2 29.85,4.75 | 29.85,4.75 26.1,4.75 v25.98,4.88 | 29.85,4.75 30.88,4.75 32.25,6.12 33.5,6.12 JP1.1
VRAM  (via drill 0.3)
  Top 0.125: IC1.H7 IC1.H6 16.7,19.9 16.7,18.5 16.9,18.3 17.3,18.3 17.5,18.1 17.5,13.7 16.5,12.7 v16.5,12.3
  Top 0.2: v13.07,9.95 12.8,9.68 8.12,9.68 v7.75,10.05 7.55,10.25 7.55,12.95
  Top 0.3: U3.5 3.85,14.59 4.35,14.09 4.35,13.1 C3.1 6.1,13.1 C32.1 7.55,13.15 | v7.45,13.38 7.55,13.27 7.55,13.15 | 7.55,13.15 7.55,12.95
  Bottom 0.125: IC2.B4 5.85,9.45 7.4,9.45 7.75,9.8 v7.75,10.05 | v7.45,13.38 7.32,13.5 5.35,13.5 IC2.E4
  Bottom 0.2: C33.1 14.9,9.9 | 14.9,9.9 14.9,10.7 v16.5,12.3 | v13.07,9.95 14.85,9.95 14.9,9.9